# EAGLE design boat7 (EAGLE 7.6.0)
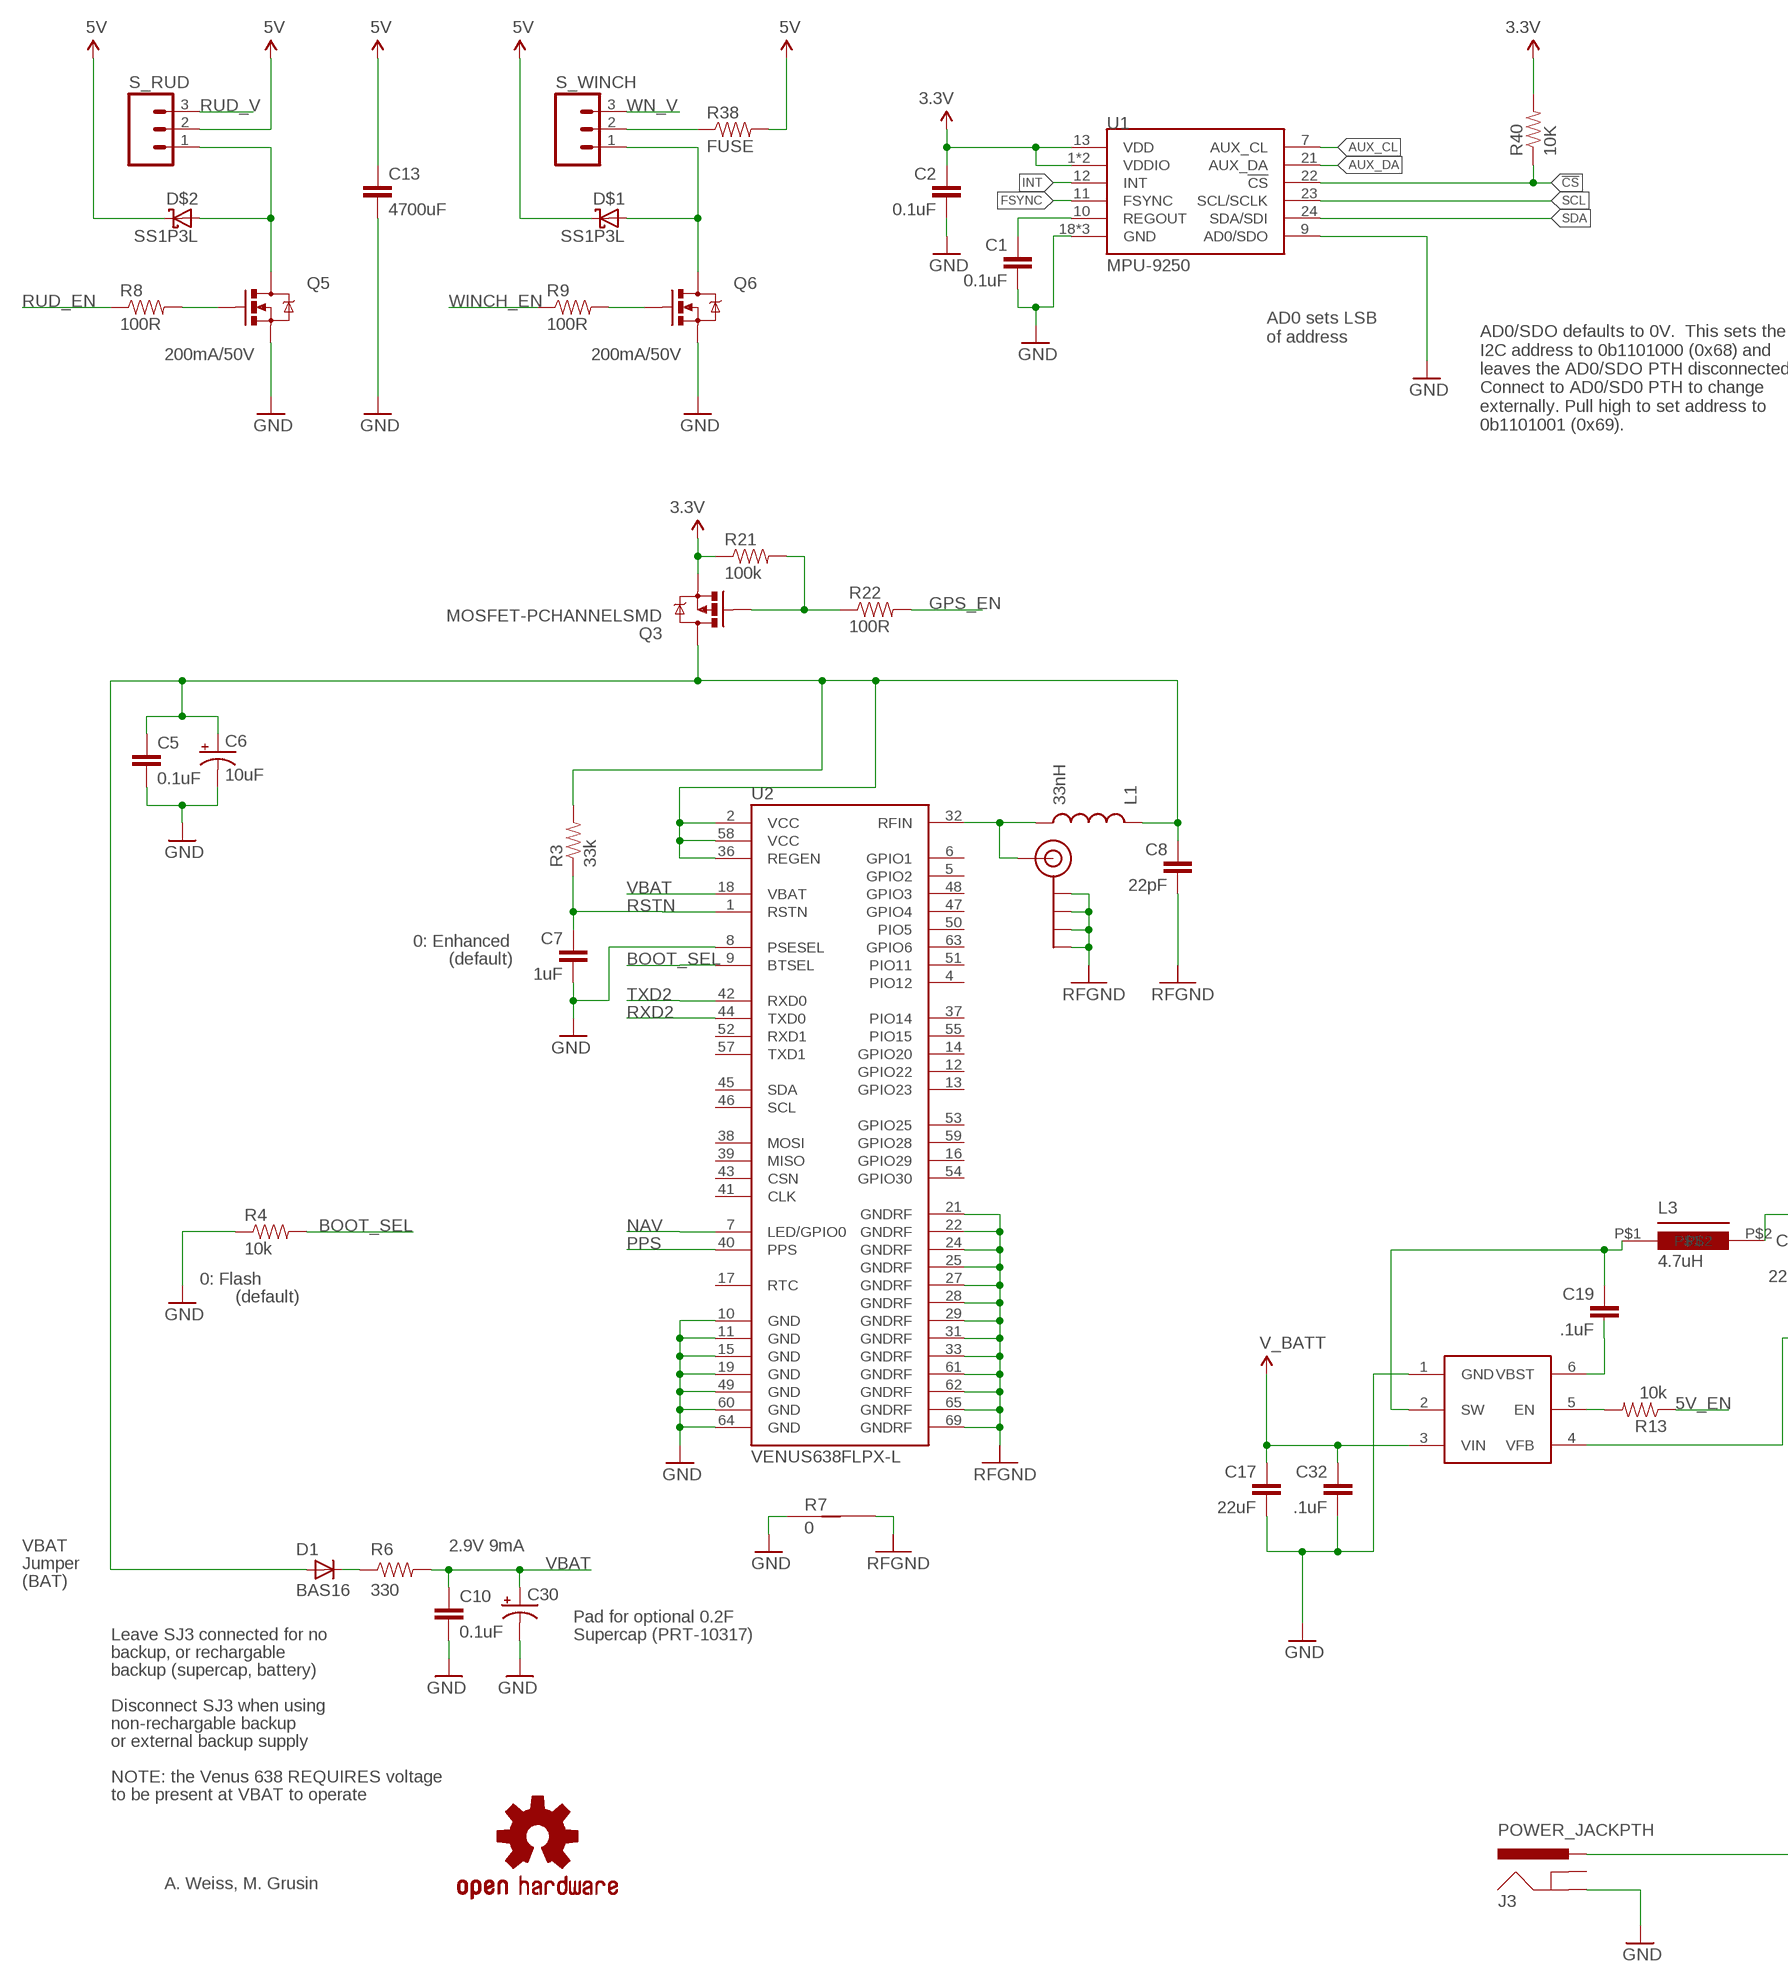
[diagram p0: schematic, sheet 1, part 1 of 2]
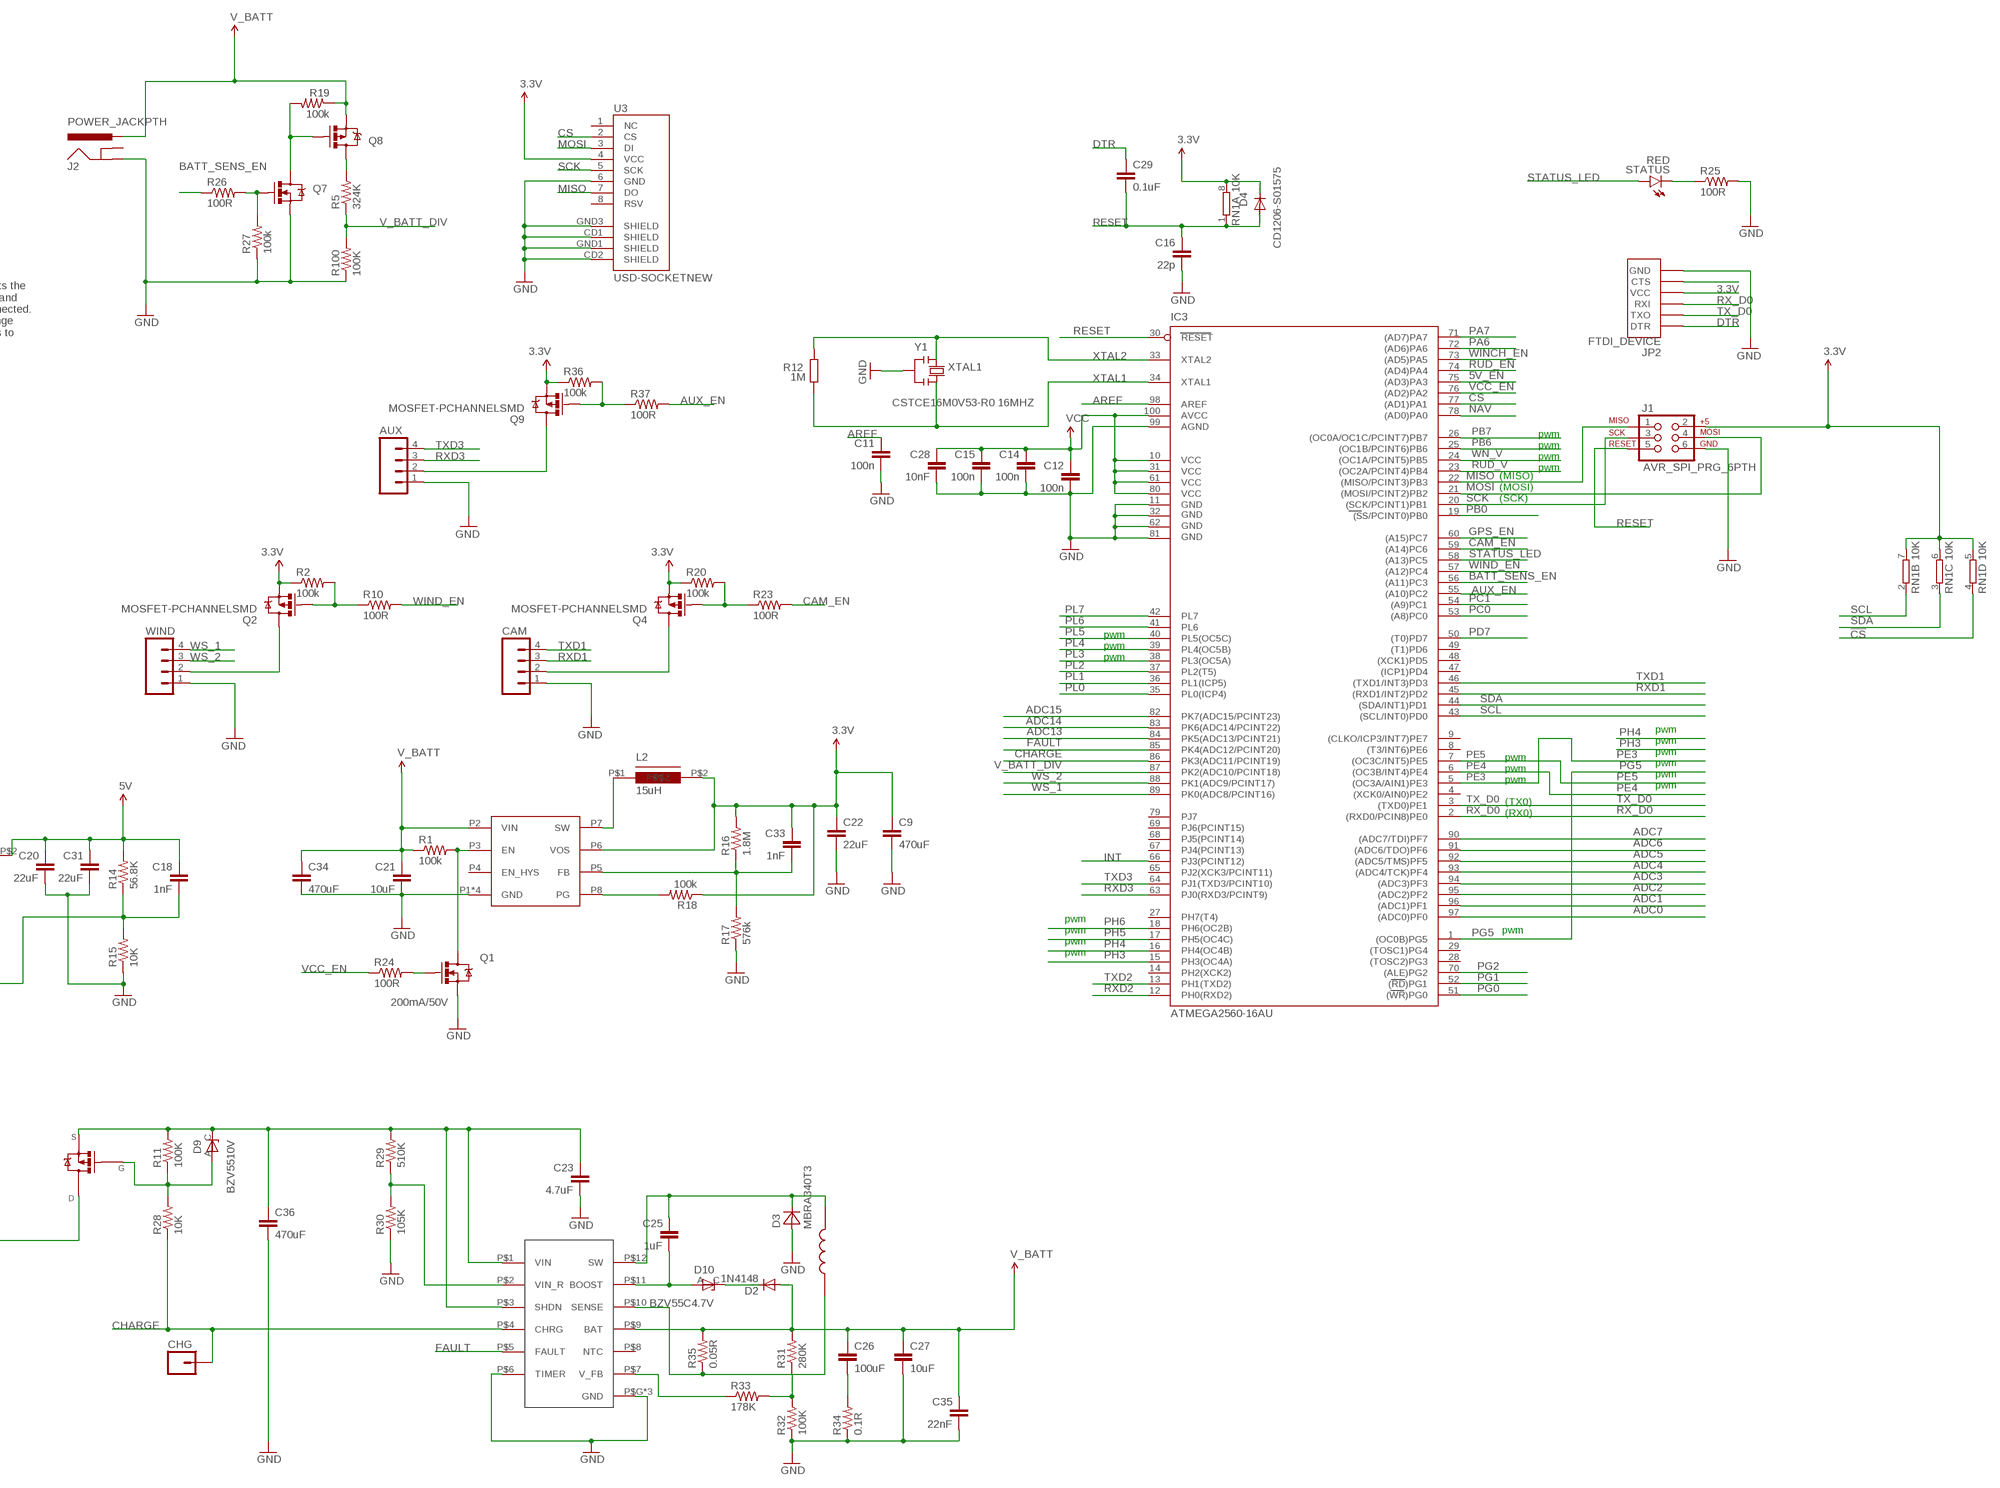
[diagram p1: schematic, sheet 1, part 2 of 2]

## Parts
AUX  M04PTH  [1X04]
C1  0.1uF  0.1UF-25V(+80/-20%)(0603)  [0603-CAP]
C2  0.1uF  0.1UF-25V(+80/-20%)(0603)  [0603-CAP]
C5  0.1uF  CAP0603-CAP  [0603-CAP]
C6  10uF  CAP_POL1206  [EIA3216]
C7  1uF  CAP0603-CAP  [0603-CAP]
C8  22pF  CAP0603-CAP  [0603-CAP]
C9  470uF  CAPPTH1  [CAP-PTH-5MM]
C10  0.1uF  CAP0603-CAP  [0603-CAP]
C11  100n  C-EU0603-RND  [C0603-ROUND]
C12  100n  C-EU0603-RND  [C0603-ROUND]
C13  4700uF  CAPPTH1  [CAP-PTH-5MM]
C14  100n  C-EU0603-RND  [C0603-ROUND]
C15  100n  C-EU0603-RND  [C0603-ROUND]
C16  22p  C-EU0603-RND  [C0603-ROUND]
C17  22uF  CAP1206  [1206]
C18  1nF  CAP0805  [0805]
C19  .1uF  CAP0805  [0805]
C20  22uF  CAP1206  [1206]
C21  10uF  CAP0805  [0805]
C22  22uF  CAP0805  [0805]
C23  4.7uF  CAP1206  [1206]
C25  1uF  CAP0805  [0805]
C26  100uF  CAP1210  [1210]
C27  10uF  CAP1210  [1210]
C28  10nF  CAP0603-CAP  [0603-CAP]
C29  0.1uF  CAP0603-CAP  [0603-CAP]
C30  CAP_POL  [DSK-621]
C31  22uF  CAP1206  [1206]
C32  .1uF  CAP0805  [0805]
C33  1nF  CAP0402-CAP  [0402-CAP]
C34  470uF  CAPPTH1  [CAP-PTH-5MM]
C35  22nF  CAP0805  [0805]
C36  470uF  CAPPTH1  [CAP-PTH-5MM]
CAM  M04PTH  [1X04]
CHG  M01PTH  [1X01]
D1  BAS16  DIODESOD  [SOD-323]
D2  1N4148  [MINIMELF]
D3  MBRA340T3  [SMA]
D4  CD1206-S01575  DIODE-SOD323-R  [SOD323-R]
D9  BZV5510V  BZV55  [MINIMELF]
D10  BZV55C4.7V  BZV55  [MINIMELF]
D$1  SS1P3L  [MICROSMP]
D$2  SS1P3L  [MICROSMP]
IC3  ATMEGA2560-16AU  ATMEGA25602560-16AU  [TQFP100]
J1  AVR_SPI_PRG_6PTH  [2X3]
J2  POWER_JACKPTH  [POWER_JACK_PTH]
J3  POWER_JACKPTH  [POWER_JACK_PTH]
JP2  FTDI_DEVICE  [FTDI_DEVICE_SIDE]
JP5  SMA_EDGE  [SMA-EDGE]
L1  33nH  INDUCTOR0603  [0603]
L2  15uH  VLCF4020  [VLCF4020]
L3  4.7uH  SLF60287055  [SLF7055]
Q1  200mA/50V  MOSFET-NCHANNELBSS138  [SOT23-3]
Q2  MOSFET-PCHANNELSMD  [SOT23-3]
Q3  MOSFET-PCHANNELSMD  [SOT23-3]
Q4  MOSFET-PCHANNELSMD  [SOT23-3]
Q5  200mA/50V  MOSFET-NCHANNELBSS138  [SOT23-3]
Q6  200mA/50V  MOSFET-NCHANNELBSS138  [SOT23-3]
Q7  200mA/50V  MOSFET-NCHANNELBSS138  [SOT23-3]
Q8  MOSFET-PCHANNELSMD  [SOT23-3]
Q9  MOSFET-PCHANNELSMD  [SOT23-3]
R1  100k  RESISTOR0603  [0603-RES]
R2  100k  RESISTOR0603  [0603-RES]
R3  33k  RESISTOR0603-RES  [0603-RES]
R4  10k  RESISTOR0603-RES  [0603-RES]
R5  324K  RESISTOR0603-RES  [0603-RES]
R6  330  RESISTOR0603-RES  [0603-RES]
R7  0  GND-JUMP  [GND-JUMP]
R8  100R  RESISTOR0603  [0603-RES]
R9  100R  RESISTOR0603  [0603-RES]
R10  100R  RESISTOR0603  [0603-RES]
R11  100K  RESISTOR0603  [0603-RES]
R12  1M  R-EU_R0603  [R0603-ROUND]
R13  10k  RESISTOR0603  [0603-RES]
R14  56.8K  RESISTOR0603  [0603-RES]
R15  10K  RESISTOR0603  [0603-RES]
R16  1.8M  RESISTOR0603  [0603-RES]
R17  576k  RESISTOR0603  [0603-RES]
R18  100k  RESISTOR0603  [0603-RES]
R19  100k  RESISTOR0603  [0603-RES]
R20  100k  RESISTOR0603  [0603-RES]
R21  100k  RESISTOR0603  [0603-RES]
R22  100R  RESISTOR0603  [0603-RES]
R23  100R  RESISTOR0603  [0603-RES]
R24  100R  RESISTOR0603  [0603-RES]
R25  100R  RESISTOR0603  [0603-RES]
R26  100R  RESISTOR0603  [0603-RES]
R27  100k  RESISTOR0603  [0603-RES]
R28  10K  RESISTOR0603  [0603-RES]
R29  510K  RESISTOR0603  [0603-RES]
R30  105K  RESISTOR0603  [0603-RES]
R31  280K  RESISTOR0603  [0603-RES]
R32  100K  RESISTOR0603  [0603-RES]
R33  178K  RESISTOR0603  [0603-RES]
R34  0.1R  RESISTOR1206  [1206]
R35  0.05R  RESISTOR1206  [1206]
R36  100k  RESISTOR0603  [0603-RES]
R37  100R  RESISTOR0603  [0603-RES]
R38  FUSE  RESISTORPTH-1/4W-VERT  [AXIAL-0.1]
R40  10K  10KOHM-1/10W-1%(0603)0603  [0603-RES]
R100  100K  RESISTOR0603-RES  [0603-RES]
RN1  10K  4R-NCAT16  [CAT16]
S_RUD  M03PTH  [1X03]
S_WINCH  M03PTH  [1X03]
STATUS  RED  LED-RED0603  [LED-0603]
U1  MPU-9250  [QFN24_PAD]
U2  VENUS638FLPX-L  [VENUS638FLPX]
U3  USD-SOCKETNEW  [MICRO-SD-SOCKET-PP]
U$1  TPS62125  [S-PWSON-N8]
U$2  TPS56X200  [SOT23-6]
U$4  OSHW-LOGOS  [OSHW-LOGO-S]
U$5  LT365212  [12-LEAD-MSOP-EXPOSED]
U$7  B82464G4  [B82464G4]
U$15  SI4401DDY  [SOIC-8]
WIND  M04PTH  [1X04]
Y1  CSTCE16M0V53-R0 16MHZ  RESONATORMU  [RESONATOR]

## Nets
3.3V: C2.1 C9.1 C12.1 C14.1 C15.1 C22.1 C28.1 C33.1 D4.C IC3.10(VCC) IC3.31(VCC1) IC3.61(VCC2) IC3.80(VCC3) IC3.100(AVCC) J1.2 JP2.P$4(VCC) L2.P$2 Q2.2(S) Q3.2(S) Q4.2(S) Q9.2(S) R2.1 R16.2 R18.1 R20.1 R21.1 R36.1 R40.2 RN1.5 RN1.6 RN1.7 RN1.8 U1.1(VDDIO) U1.8(VDDIO) U1.13(VDD) U3.4(VCC) U$1.P6(VOS) ; supply symbol labelled VCC
5V: C13.1 C18.1 C20.1 C31.1 D$1.C D$2.C L3.P$2 R14.2 R38.P$2 S_RUD.2
5V_EN: IC3.75((AD3)PA3) R13.1
!CS: R40.1 RN1.4 U1.22(!CS)
ADC0: IC3.97((ADC0)PF0)
ADC1: IC3.96((ADC1)PF1)
ADC2: IC3.95((ADC2)PF2)
ADC3: IC3.94((ADC3)PF3)
ADC4: IC3.93((ADC4/TCK)PF4)
ADC5: IC3.92((ADC5/TMS)PF5)
ADC6: IC3.91((ADC6/TDO)PF6)
ADC7: IC3.90((ADC7/TDI)PF7)
ADC13: IC3.84(PK5(ADC13/PCINT21))
ADC14: IC3.83(PK6(ADC14/PCINT22))
ADC15: IC3.82(PK7(ADC15/PCINT23))
ANT: JP5.SIG(SIGNAL) L1.2 U2.32(RFIN)
AREF: C11.1 IC3.98(AREF)
AUX_CL: U1.7(AUX_CL)
AUX_DA: U1.21(AUX_DA)
AUX_EN: IC3.55((A10)PC2) R37.2
BAT: C17.1 C21.1 C26.1 C27.1 C32.1 C34.1 C35.1 D2.A J2.PWR Q8.2(S) R1.1 R19.1 R31.2 R35.2 U$1.P2(VIN) U$2.3(VIN) U$5.P$9(BAT) ; supply symbol labelled V_BATT
BATT_SENS_EN: IC3.56((A11)PC3) R26.1
BOOST: C25.2 D10.A U$5.P$11(BOOST)
BOOT_SEL: R4.2 U2.9(BTSEL)
CAM_EN: IC3.59((A14)PC6) R23.2
CHARGE: CHG.1 IC3.86(PK3(ADC11/PCINT19)) R28.1 U$5.P$4(CHRG)
CS: IC3.77((AD1)PA1) U3.2(CS)
DTR: C29.1 JP2.P$1(DTR)
FAULT: IC3.85(PK4(ADC12/PCINT20)) U$5.P$5(FAULT)
FSYNC: U1.11(FSYNC)
GND: AUX.1 C1.2 C2.2 C5.2 C6.C(-) C7.2 C9.2 C10.2 C11.2 C12.2 C13.2 C14.2 C15.2 C16.2 C17.2 C20.2 C21.2 C22.2 C23.2 C27.2 C28.2 C30.GND(-) C31.2 C32.2 C34.2 C35.2 C36.2 CAM.1 D3.A IC3.11(GND) IC3.32(GND1) IC3.62(GND2) IC3.81(GND3) IC3.99(AGND) J1.6 J2.GND J3.GND JP2.P$6(GND) Q1.2(S) Q5.2(S) Q6.2(S) Q7.2(S) R4.1 R7.1 R15.1 R17.1 R25.2 R27.1 R30.1 R32.1 R34.1 R100.1 U1.9(AD0/SDO) U1.18(GND) U1.20(GND) U1.CENTER(GND) U2.8(PSESEL) U2.10(GND) U2.11(GND) U2.15(GND) U2.19(GND) U2.49(GND) U2.60(GND) U2.64(GND) U3.6(GND) U3.CD1(SHIELD) U3.CD2(SHIELD) U3.GND1(SHIELD) U3.GND3(SHIELD) U$1.P1(GND) U$1.P_THERM(GND) U$1.P_THERM_VIA1(GND) U$1.P_THERM_VIA(GND) U$2.1(GND) U$5.P$6(TIMER) U$5.P$G1(GND) U$5.P$G2(GND) U$5.P$G(GND) WIND.1 Y1.2
GPS_EN: IC3.60((A15)PC7) R22.2
GPS_PWR: C5.1 C6.A(+) C8.1 D1.2(A) L1.1 Q3.3(D) R3.2 U2.2(VCC) U2.36(REGEN) U2.58(VCC)
INT: IC3.66(PJ3(PCINT12)) U1.12(INT)
MISO: IC3.22((MISO/PCINT3)PB3) J1.1 U3.7(DO)
MOSI: IC3.21((MOSI/PCINT2)PB2) J1.4 U3.3(DI)
N$1: R38.P$1 S_WINCH.2
N$3: AUX.2 Q9.3(D)
N$4: C23.1 C36.1 D9.C(K) R11.2 R29.2 U$5.P$1(VIN) U$5.P$3(SHDN) U$15.1(S) U$15.2(S) U$15.3(S)
N$5: D1.1(C) R6.1
N$6: D9.A R11.1 R28.2 U$15.4(G)
N$7: Q5.1(G) R8.2
N$8: D$1.A Q6.3(D) S_WINCH.1
N$9: D$2.A Q5.3(D) S_RUD.1
N$10: Q6.1(G) R9.2
N$11: C19.1 L3.P$1 U$2.2(SW)
N$12: Q9.1(G) R36.2 R37.1
N$13: R31.1 R32.2 R33.2
N$14: L2.P$1 U$1.P7(SW)
N$15: R13.2 U$2.5(EN)
N$17: C33.2 R16.1 R17.2 U$1.P5(FB)
N$18: R18.2 U$1.P8(PG)
N$19: C18.2 R14.1 R15.2 U$2.4(VFB)
N$20: CAM.2 Q4.3(D)
N$21: Q4.1(G) R20.2 R23.1
N$22: Q3.1(G) R21.2 R22.1
N$23: Q1.3(D) R1.2 U$1.P3(EN)
N$24: Q1.1(G) R24.2
N$25: JP2.P$5(CTS)
N$26: Q2.3(D) WIND.2
N$27: R25.1 STATUS.C
N$28: Q2.1(G) R2.2 R10.1
N$29: Q8.3(D) R5.2
N$30: Q7.3(D) Q8.1(G) R19.2
N$31: Q7.1(G) R26.2 R27.2
N$32: C19.2 U$2.6(VBST)
N$36: C26.2 R34.2
N$37: D2.C D10.C(K)
NAV: IC3.78((AD0)PA0) U2.7(LED/GPIO0)
PA6: IC3.72((AD6)PA6)
PA7: IC3.71((AD7)PA7)
PB0: IC3.19((SS/PCINT0)PB0)
PB6: IC3.25((OC1B/PCINT6)PB6)
PB7: IC3.26((OC0A/OC1C/PCINT7)PB7)
PC0: IC3.53((A8)PC0)
PC1: IC3.54((A9)PC1)
PD7: IC3.50((T0)PD7)
PE3: IC3.5((OC3A/AIN1)PE3)
PE4: IC3.6((OC3B/INT4)PE4)
PE5: IC3.7((OC3C/INT5)PE5)
PG0: IC3.51((WR)PG0)
PG1: IC3.52((RD)PG1)
PG2: IC3.70((ALE)PG2)
PG5: IC3.1((OC0B)PG5)
PH3: IC3.15(PH3(OC4A))
PH4: IC3.16(PH4(OC4B))
PH5: IC3.17(PH5(OC4C))
PH6: IC3.18(PH6(OC2B))
PL0: IC3.35(PL0(ICP4))
PL1: IC3.36(PL1(ICP5))
PL2: IC3.37(PL2(T5))
PL3: IC3.38(PL3(OC5A))
PL4: IC3.39(PL4(OC5B))
PL5: IC3.40(PL5(OC5C))
PL6: IC3.41(PL6)
PL7: IC3.42(PL7)
PPS: U2.40(PPS)
REGOUT: C1.1 U1.10(REGOUT)
RESET: C16.1 C29.2 D4.A IC3.30(RESET) J1.5 RN1.1
RFGND: C8.2 JP5.GND@0(GND) JP5.GND@1(GND) JP5.GND@2(GND) JP5.GND@3(GND) R7.2 U2.21(GNDRF) U2.22(GNDRF) U2.24(GNDRF) U2.25(GNDRF) U2.27(GNDRF) U2.28(GNDRF) U2.29(GNDRF) U2.31(GNDRF) U2.33(GNDRF) U2.61(GNDRF) U2.62(GNDRF) U2.65(GNDRF) U2.69(GNDRF)
RSTN: C7.1 R3.1 U2.1(RSTN)
RUD_EN: IC3.74((AD4)PA4) R8.1
RUD_V: IC3.23((OC2A/PCINT4)PB4) S_RUD.3
RX_D0: IC3.2((RXD0/PCIN8)PE0) JP2.P$3(RXI)
RXD1: CAM.3 IC3.45((RXD1/INT2)PD2)
RXD2: IC3.12(PH0(RXD2)) U2.44(TXD0)
RXD3: AUX.3 IC3.63(PJ0(RXD3/PCINT9))
S_IN: J3.PWR U$15.5(D) U$15.6(D) U$15.7(D) U$15.8(D)
SCK: IC3.20((SCK/PCINT1)PB1) J1.3 U3.5(SCK)
SCL: IC3.43((SCL/INT0)PD0) RN1.2 U1.23(SCL/SCLK)
SDA: IC3.44((SDA/INT1)PD1) RN1.3 U1.24(SDA/SDI)
SENSE: R35.1 U$5.P$10(SENSE) U$7.P$1
STATUS_LED: IC3.58((A13)PC5) STATUS.A
SW: C25.1 D3.C U$5.P$12(SW) U$7.P$2
TX_D0: IC3.3((TXD0)PE1) JP2.P$2(TXO)
TXD1: CAM.4 IC3.46((TXD1/INT3)PD3)
TXD2: IC3.13(PH1(TXD2)) U2.42(RXD0)
TXD3: AUX.4 IC3.64(PJ1(TXD3/PCINT10))
V_BATT_DIV: IC3.87(PK2(ADC10/PCINT18)) R5.1 R100.2
VBAT: C10.1 C30.VCC(+) R6.2 U2.18(VBAT)
VCC_EN: IC3.76((AD2)PA2) R24.1
VFB: R33.1 U$5.P$7(V_FB)
VINR: R29.1 R30.2 U$5.P$2(VIN_R)
WINCH_EN: IC3.73((AD5)PA5) R9.1
WIND_EN: IC3.57((A12)PC4) R10.2
WN_V: IC3.24((OC1A/PCINT5)PB5) S_WINCH.3
WS_1: IC3.89(PK0(ADC8/PCINT16)) WIND.4
WS_2: IC3.88(PK1(ADC9/PCINT17)) WIND.3
XTAL1: IC3.34(XTAL1) R12.1 Y1.3
XTAL2: IC3.33(XTAL2) R12.2 Y1.1
Unconnected: IC3.4((XCK0/AIN0)PE2) IC3.8((T3/INT6)PE6) IC3.9((CLKO/ICP3/INT7)PE7) IC3.14(PH2(XCK2)) IC3.27(PH7(T4)) IC3.28((TOSC2)PG3) IC3.29((TOSC1)PG4) IC3.47((ICP1)PD4) IC3.48((XCK1)PD5) IC3.49((T1)PD6) IC3.65(PJ2(XCK3/PCINT11)) IC3.67(PJ4(PCINT13)) IC3.68(PJ5(PCINT14)) IC3.69(PJ6(PCINT15)) IC3.79(PJ7) J2.GNDBREAK J3.GNDBREAK U2.4(PIO12) U2.5(GPIO2) U2.6(GPIO1) U2.12(GPIO22) U2.13(GPIO23) U2.14(GPIO20) U2.16(GPIO29) U2.17(RTC) U2.37(PIO14) U2.38(MOSI) U2.39(MISO) U2.41(CLK) U2.43(CSN) U2.45(SDA) U2.46(SCL) U2.47(GPIO4) U2.48(GPIO3) U2.50(PIO5) U2.51(PIO11) U2.52(RXD1) U2.53(GPIO25) U2.54(GPIO30) U2.55(PIO15) U2.57(TXD1) U2.59(GPIO28) U2.63(GPIO6) U3.1(NC) U3.8(RSV) U$1.P4(EN_HYS) U$5.P$8(NTC)

## Notes on the sheet
- AD0/SDO defaults to 0V.  This sets the
  I2C address to 0b1101000 (0x68) and
  leaves the AD0/SDO PTH disconnected.
  Connect to AD0/SD0 PTH to change
  externally. Pull high to set address to
  0b1101001 (0x69).
- AD0 sets LSB
  of address
- pwm
- pwm
- pwm
- pwm
- (MISO)
- (MOSI)
- (SCK)
- pwm
- pwm
- pwm
- 0: Enhanced
- (default)
- RFGND | RFGND
- pwm
- pwm
- pwm
- pwm
- pwm
- pwm
- pwm
- pwm
- pwm
- (TX0)
- (RX0)
- 0: Flash
- (default)
- pwm
- pwm | pwm
- pwm
- pwm
- RFGND
- VBAT | 2.9V 9mA
- Jumper | RFGND
- (BAT)
- Pad for optional 0.2F
- Leave SJ3 connected for no | Supercap (PRT-10317)
- backup, or rechargable
- backup (supercap, battery)
- Disconnect SJ3 when using
- non-rechargable backup
- or external backup supply
- NOTE: the Venus 638 REQUIRES voltage
- to be present at VBAT to operate
- A. Weiss, M. Grusin

## Library data of the parts
AUX CAM WIND = SparkFun-Connectors:M04: Header 4 Standard 4-pin 0.1" header. Use with straight break away headers (SKU : PRT-00116), right angle break away headers (PRT-00553), swiss pins (PRT-00743), machine pins (PRT-00117), and female headers (PRT-00115). Molex polarized connector foot print use with SKU : PRT-08231 with associated crimp pins and housings. 1MM SMD Version SKU: PRT-10208; PROD_ID: CONN-09696
C1 C2 = SparkFun-Capacitors:0.1UF-25V(+80/-20%)(0603): CAP-00810 Ceramic Standard decoupling cap; PROD_ID: CAP-00810
C5 C7 C8 C10 = SparkFun:CAP: Capacitor Standard 0603 ceramic capacitor, and 0.1" leaded capacitor.
C6 = SparkFun:CAP_POL: Capacitor Polarized These are standard SMD and PTH capacitors. Normally 10uF, 47uF, and 100uF in electrolytic and tantalum varieties. Always verify the external diameter of the through hole cap, it varies with capacity, voltage, and manufacturer. The EIA devices should be standard.
C9 C13 C17-C23 C25-C27 C31 C32 C34-C36 = SparkFun-Capacitors:CAP: Capacitor Standard 0603 ceramic capacitor, and 0.1" leaded capacitor.
C11 C12 C14-C16 = SmartPrj:C-EU: CAPACITOR, European symbol
C28 C29 C33 = SparkFun-Passives:CAP: Capacitor Standard 0603 ceramic capacitor, and 0.1" leaded capacitor.
C30 = kolosy:CAP_POL: Capacitor Polarized These are standard SMD and PTH capacitors. Normally 10uF, 47uF, and 100uF in electrolytic and tantalum varieties. Always verify the external diameter of the through hole cap, it varies with capacity, voltage, and manufacturer. The EIA devices should be standard.
CHG = SparkFun-Connectors:M01: Header 1 Standard 1-pin 0.1" header. Use with straight break away headers (SKU : PRT-00116), right angle break away headers (PRT-00553), swiss pins (PRT-00743), machine pins (PRT-00117), and female headers (PRT-00115). SMTSO-256-ET is a "flush mount" nut for a 4-40 screw. The older package used to be too tight, and did not allow it to sit properly thru the drill hit. The latest (0.165DIA) fits nice and snug.
D1 = SparkFun:DIODE: Diode These are standard reverse protection diodes and small signal diodes. SMA package can handle up to about 1A. SOD-323 can handle about 200mA. What the SOD-323 package when ordering, there are some mfgs out there that are 5-pin packages.
D2 = kolosy:1N4148: DIODE high speed (Philips)
D3 = diode:MBRA340T3: Surface Mount Schottky Power Rectifier Source: http://www.onsemi.com/pub_link/Collateral/MBRA340T3-D.PDF
D4 = diode:DIODE-: DIODE
D9 D10 = kolosy:BZV55
D$1 D$2 = kolosy:SS1P3L: Surface Mount Schottky Barrier Rectifiers (http://www.vishay.com/docs/89020/mss1p3l.pdf)
IC3 = SmartPrj:ATMEGA2560: MICROCONTROLLER 64/128/256 Kbytes FLASH 4 Kbytes EEPROM 8 Kbytes SRAM 86 General Purpose I/O pins 12-channels16-bit PWM 4 x Serial USARTs 16-channels 10-bit A/D
J1 = SparkFun-Connectors:AVR_SPI_PRG_6: AVR ISP 6 Pin This is the reduced ISP connector for AVR programming. Common on Arduino. This footprint will take up less PCB space and can be used with a 10-pin to 6-pin adapter such as SKU: BOB-08508 **Special note about "TEST_POINT" package. The stop mask is on the top side, so if you want your programming test points to be on the bottom of your board, make sure to place this package on the bottom side of the board. This also ensure that the orientation to program from the bottom side will be correct.
J2 J3 = SparkFun-Connectors:POWER_JACK: Power Jack This is the standard 5.5mm barrel jack for power. The PTH is the most common, proven, reliable, footprint. The Slot footprint only works if the mill layer is transmitted to the PCB fab house so be warned. Mating wall wart : TOL-00298 (and others); PROD_ID: CONN-08197
JP2 = SparkFun-Connectors:FTDI_DEVICE: Connector which mates to FTDI basic or FTDI cable.
JP5 = SparkFun:SMA_EDGE: SMA Antenna Connector End launch SMA connector. The paste layer has been removed so that the connector can be hand soldered onto the board after reflow.
L1 = SparkFun:INDUCTOR: Inductors Basic Inductor/Choke - 0603 and 1206. Footprints are not proven and vary greatly between part numbers.
L2 = kolosy:VLCF4020
L3 = kolosy:SLF6028
Q1 Q5-Q7 = SparkFun-DiscreteSemi:MOSFET-NCHANNEL: Common NMOSFET Parts MFG P/N Store ID Prod ID FDD8780 TRANS-09984 SI7820DN TRANS-11055 FDS6630A IC-08089 2N7002PW TRANS-11151 FQP30N06L COM-10213 TRANS-10060 BSS123LT1G TRANS-08345 BSS138 TRANS-00830 BS170 2N7000; PROD_ID: TRANS-00830
Q2-Q4 Q8 Q9 = SparkFun-DiscreteSemi:MOSFET-PCHANNEL: Generic PMOSFET IRLML2244 - TRANS-11153 (SOT-23 -20V -4.3A) (1.Gate 2.Source 3.Drain) FQP27P06 - COM-10349 <http://www.sparkfun.com/products/10349> (TO-220 -60V -27A) (1.Gate 2.Source 3.Drain)
R1 R2 R8-R11 R13-R38 = SparkFun-Resistors:RESISTOR: Resistor Basic schematic elements and footprints for 0603, 1206, and PTH resistors.
R3 R4 R6 = SparkFun:RESISTOR: Resistor Basic schematic elements and footprints for 0603, 1206, and PTH resistors.
R5 R100 = SparkFun-Passives:RESISTOR: Resistor Basic schematic elements and footprints for 0603, 1206, and PTH resistors.
R7 = mike-temp:GND-JUMP: Zero-Ohm trace for connecting different ground planes at a single point.
R12 = SmartPrj:R-EU_: RESISTOR, European symbol
R40 = SparkFun-Resistors:10KOHM-1/10W-1%(0603): RES-00824; PROD_ID: RES-00824
RN1 = resistor-dil:4R-N: Array Chip Resistor Source: RS Component / Phycomp; OC_FARNELL: unknown; OC_NEWARK: unknown
S_RUD S_WINCH = SparkFun-Connectors:M03: Header 3 Standard 3-pin 0.1" header. Use with straight break away headers (SKU : PRT-00116), right angle break away headers (PRT-00553), swiss pins (PRT-00743), machine pins (PRT-00117), and female headers (PRT-00115). Molex polarized connector foot print use with SKU : PRT-08232 with associated crimp pins and housings.
STATUS = SparkFun-LED:LED-RED: Assorted Red LEDs LilyPad 1206- DIO-09912 1206- DIO-00809 0603- DIO-00819 "SMART" means more efficient and expensive; PROD_ID: DIO-00819
U1 = Testing:MPU-9250: NC pin 19. 2-6 & 14-17 not internally connected. May be used for PCB trace routing.; PROD_ID: IC-13192
U2 = mike-temp:VENUS638FLPX-L: Venus638FLPX-L GPS Receiver Venus638FLPx is a high performance, low cost, single chip GPS receiver targeting mobile consumer and cellular handset applications. It offers very low power consumption, high sensitivity, and best in class signal acquisition and time-to-first-fix performance. Venus638FLPx contains all the necessary components of a complete GPS receiver, includes 1.2dB cascaded system NF RF front-end, GPS baseband signal processor, 0.5ppm TCXO, 32.768kHz RTC crystal, RTC LDO regulator, and passive components. It requires very low external component count and takes up only 100mm2 PCB footprint. Dedicated massive-correlator signal parameter search engine within the baseband enables rapid search of all the available satellites and acquisition of very weak signal. An advanced track engine allows weak signal tracking and positioning in harsh environments such as urban canyons and under deep foliage. The self-contained architecture keeps GPS processing off the host and allows integration into applications with very little resource. FEATURES 20Hz update rate -148dBm cold start sensitivity -165dBm tracking sensitivity 29 second cold start TTFF 3.5 second TTFF with AGPS 1 second hot start 2.5m accuracy Multipath detection and suppression Jamming detection and mitigation SBAS (WAAS / EGNOS) support 7-day extended ephemeris AGPS 67mW full power navigation Works directly with active or passive antenna Internal flash for optional 75K point data logging Supports external SPI flash memory data logging Complete receiver in 10mm x 10mm x 1.3mm size Contains LNA, SAW Filter, TCXO, RTC Xtal, LDO Pb-free RoHS compliant
U3 = SparkFun:USD-SOCKET: microSD Socket Push-push type uSD socket. Schematic element and footprint production proven. Spark Fun Electronics SKU : PRT-00127. tDoc lines correctly indicate media card edge positions when inserting (unlocked, locked, depressed).
U$1 = kolosy:TPS62125
U$2 = kolosy:TPS56X200
U$4 = SparkFun:OSHW-LOGO: Open Source Hardware Logo This logo indicates the piece of hardware it is found on incorporates a OSHW license and/or adheres to the definition of open source hardware found here: http://freedomdefined.org/OSHW
U$5 = kolosy:LT3652: The LT®3652 is a complete monolithic step-down battery charger that operates over a 4.95V to 32V input voltage range. The LT3652 provides a constant-current/ constant-voltage charge characteristic, with maximum charge current externally programmable up to 2A. The charger employs a 3.3V float voltage feedback reference, so any desired battery float voltage up to 14.4V can be programmed with a resistor divider.
U$7 = kolosy:B82464G4
U$15 = kolosy:SI4401DDY: VISHAY P-Channel 40 V (D-S) MOSFET
Y1 = SmartPrj:RESONATOR

## Net classes
2 gnd: width 0.305 mm, drill 0.406 mm, clearance 0.203 mm
3 power usb: width 0.508 mm, drill 0.406 mm, clearance 0.203 mm

## Board
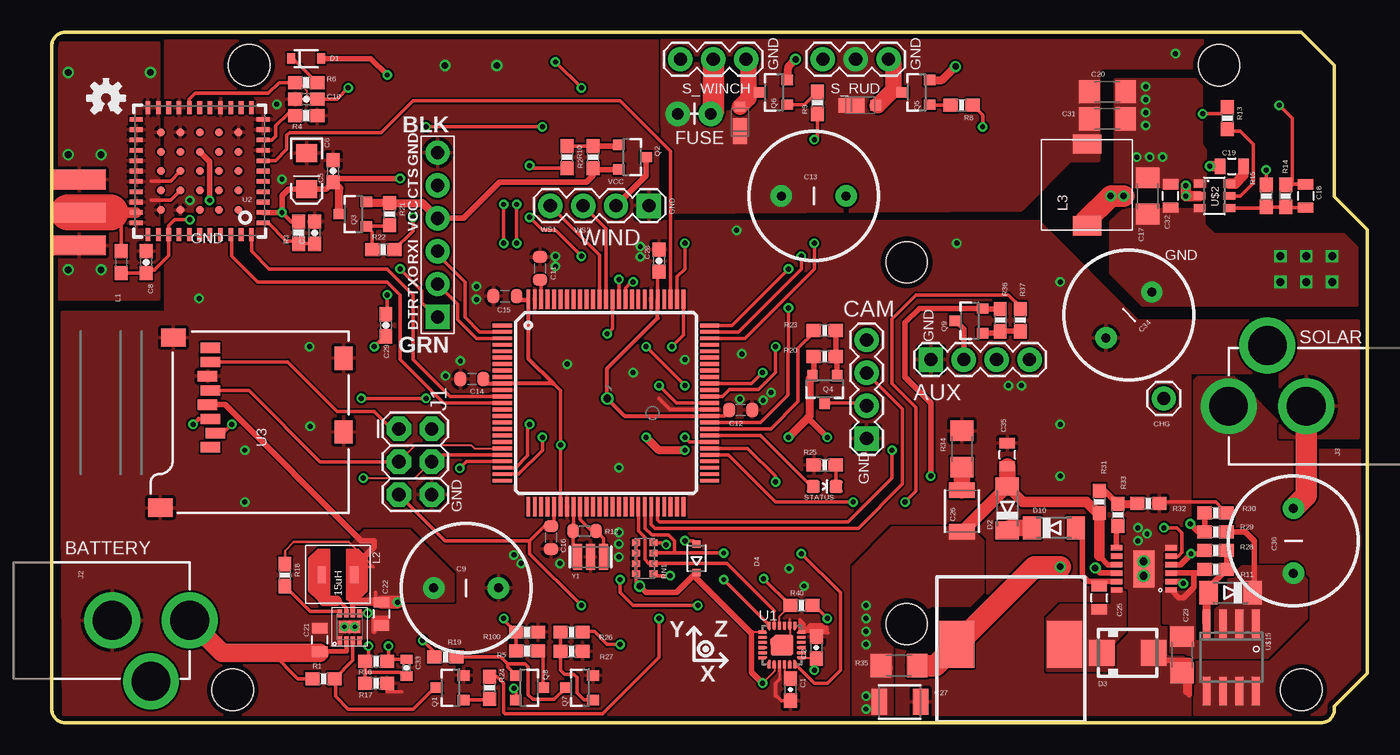
[diagram p2: board, top side]
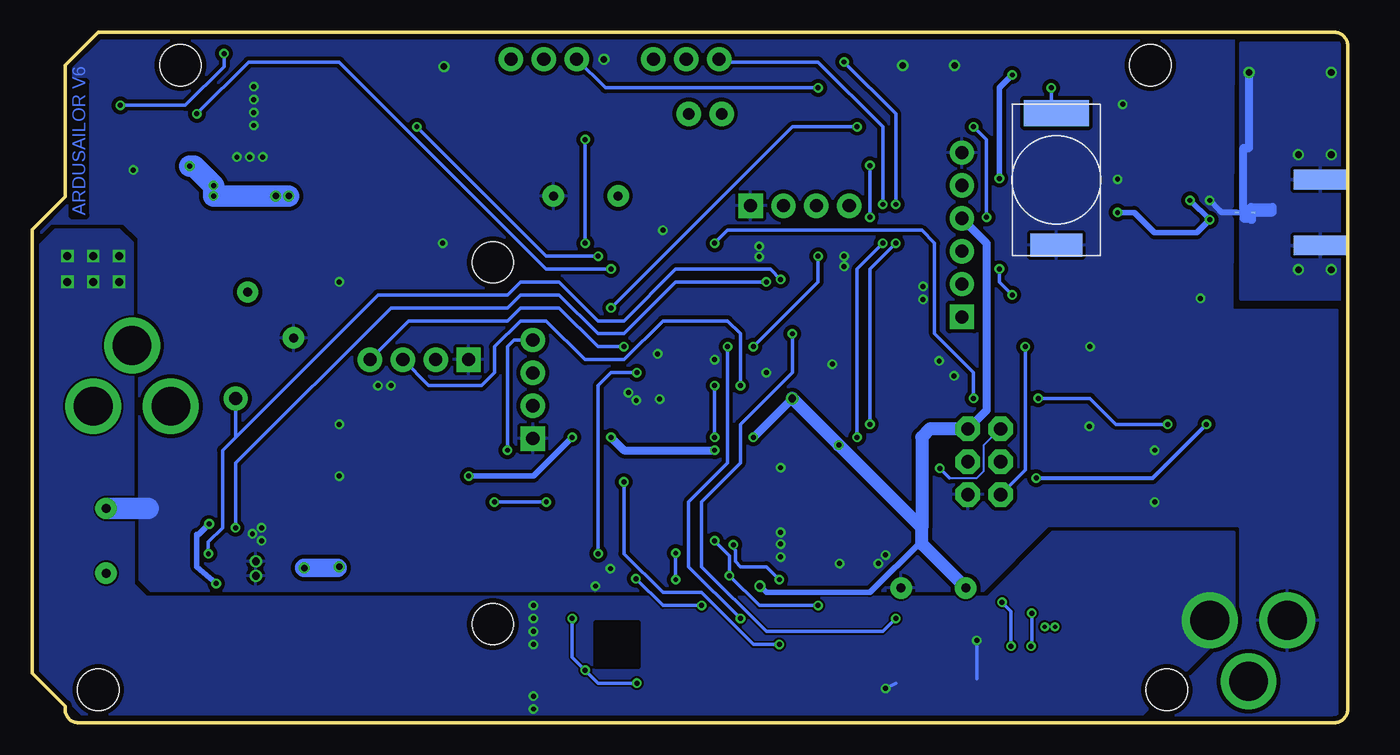
[diagram p3: board, bottom side, seen from below]

Size 101.6 x 53.34 mm. Coordinates in mm from the lower left corner, seen from the top.
Outline: 96.52,53.34 99.06,50.8 99.06,40.64 101.6,38.1 101.6,3.81 99.06,1.27 99.06,1 arc-90 98.06,0 1,0 arc-90 0,1 0,52.34 arc-90 1,53.34 96.52,53.34
Copper layers (1*16): Top 0.0356mm / dielectric 1.5011mm / Bottom 0.0356mm
Design rules "oshpark *": minimum track width 0.1523mm, minimum drill 0.3301mm, track to track 0.1523mm, track to pad 0.1523mm, pad to pad 0.1523mm, via to via 0.1523mm, smd to smd 0.1523mm, copper to edge 0.3809mm, drill to drill 0.1523mm, minimum pad ring 7mil, minimum via ring 7mil, stop-mask expansion 3mil, vias tented up to drill 15mil, thermal gap 10mil
Holes 3.2 mm at 96.52,2.54 15.24,50.8 90.17,50.8 13.97,2.54 66.04,35.56 66.04,7.62
bRestrict: area 54.8,4.3 to 58,7.7

### Footprints (pad centres in the part's own frame; a part is rotated, then mirrored left to right if it is on the bottom)
1X04 = drill 1.016 pad 1.88 square: 1 0,0 | drill 1.016 pad 1.88: 2 2.54,0; 3 5.08,0; 4 7.62,0
0603-CAP = smd 1.1 x 1: 1 -0.85,0; 2 0.85,0
EIA3216 = smd 1.4 x 1.6: A 1.4,0; C -1.4,0
CAP-PTH-5MM = drill 0.7 pad 1.651: 1 -2.5,0; 2 2.5,0
C0603-ROUND = smd 0.898 x 1.1: 1 -0.889,0; 2 0.889,0
1206 = smd 1.6 x 1.8: 1 -1.4,0; 2 1.4,0
0805 = smd 0.8 x 1.2: 1 -0.9,0; 2 0.9,0
1210 = smd 1.2 x 2: 1 -1.6,0; 2 1.6,0
DSK-621 = smd 4 x 1.8: GND 0,-5.05 | smd 5 x 2: VCC 0,5.15
0402-CAP = smd 0.7 x 0.9: 1 -0.65,0; 2 0.65,0
1X01 = drill 1.016 pad 1.88: 1 0,0
SOD-323 = smd 0.63 x 0.83: 1 -1.15,0; 2 1.15,0
MINIMELF = smd 1.4 x 1.8: A 1.7,0; C -1.7,0
SMA = smd 2 x 2: A 2,0; C -2,0
SOD323-R = smd 0.6 x 0.6: A 1.1,0; C -1.1,0
MICROSMP = smd 0.8 x 0.8: A 1.2,0 | smd 2 x 1.1: C -0.7,0
TQFP100 = smd 1.5 x 0.3: 1 -8,6; 2 -8,5.5; 3 -8,5; 4 -8,4.5; 5 -8,4; 6 -8,3.5; 7 -8,3; 8 -8,2.5; 9 -8,2; 10 -8,1.5; 11 -8,1; 12 -8,0.5; 13 -8,0; 14 -8,-0.5; 15 -8,-1; 16 -8,-1.5; 17 -8,-2; 18 -8,-2.5; 19 -8,-3; 20 -8,-3.5; 21 -8,-4; 22 -8,-4.5; 23 -8,-5; 24 -8,-5.5; 25 -8,-6; 51 8,-6; 52 8,-5.5; 53 8,-5; 54 8,-4.5; 55 8,-4; 56 8,-3.5; 57 8,-3; 58 8,-2.5; 59 8,-2; 60 8,-1.5; 61 8,-1; 62 8,-0.5; 63 8,0; 64 8,0.5; 65 8,1; 66 8,1.5; 67 8,2; 68 8,2.5; 69 8,3; 70 8,3.5; 71 8,4; 72 8,4.5; 73 8,5; 74 8,5.5; 75 8,6 | smd 0.3 x 1.5: 26 -6,-8; 27 -5.5,-8; 28 -5,-8; 29 -4.5,-8; 30 -4,-8; 31 -3.5,-8; 32 -3,-8; 33 -2.5,-8; 34 -2,-8; 35 -1.5,-8; 36 -1,-8; 37 -0.5,-8; 38 0,-8; 39 0.5,-8; 40 1,-8; 41 1.5,-8; 42 2,-8; 43 2.5,-8; 44 3,-8; 45 3.5,-8; 46 4,-8; 47 4.5,-8; 48 5,-8; 49 5.5,-8; 50 6,-8; 76 6,8; 77 5.5,8; 78 5,8; 79 4.5,8; 80 4,8; 81 3.5,8; 82 3,8; 83 2.5,8; 84 2,8; 85 1.5,8; 86 1,8; 87 0.5,8; 88 0,8; 89 -0.5,8; 90 -1,8; 91 -1.5,8; 92 -2,8; 93 -2.5,8; 94 -3,8; 95 -3.5,8; 96 -4,8; 97 -4.5,8; 98 -5,8; 99 -5.5,8; 100 -6,8
2X3 = drill 1.016 pad 1.88 octagon: 1 0,0; 2 0,2.54; 3 2.54,0; 4 2.54,2.54; 5 5.08,0; 6 5.08,2.54
POWER_JACK_PTH = drill 2.997 pad 4.318: GND 0,7.7; GNDBREAK 4.7,10.7; PWR 0,13.7
FTDI_DEVICE_SIDE = drill 1.016 pad 1.88 square: P$1 -6.35,0 | drill 1.016 pad 1.88: P$2 -3.81,0; P$3 -1.27,0; P$4 1.27,0; P$5 3.81,0; P$6 6.35,0
SMA-EDGE = smd 1.524 x 4.064: GND@0 0,0; GND@1 5.08,0; SIG 2.54,0 | smd 1.524 x 4.064 bottom: GND@2 0,0; GND@3 5.08,0
0603 = smd 1.1 x 1: 1 -0.85,0; 2 0.85,0
VLCF4020 = smd 1.27 x 0.635: P$1 0,1.27; P$2 0,-1.27
SLF7055 = smd 1.5 x 2.2: P$1 -3.15,0; P$2 3.15,0
SOT23-3 = smd 0.8 x 0.9: 1 -0.95,-1; 2 0.95,-1; 3 0,1.1
0603-RES = smd 1.1 x 1: 1 -0.85,0; 2 0.85,0
GND-JUMP = smd 0.305 x 0.152: 1 -0.635,0; 2 0.635,0
R0603-ROUND = smd 0.898 x 1.1: 1 -0.889,0; 2 0.889,0
AXIAL-0.1 = drill 0.9 pad 1.88: P$1 0,0; P$2 2.54,0
CAT16 = smd 0.5 x 0.65: 1 -1.2,-0.675; 2 -0.4,-0.675; 3 0.4,-0.675; 4 1.2,-0.675; 5 1.2,0.675; 6 0.4,0.675; 7 -0.4,0.675; 8 -1.2,0.675
1X03 = drill 1.016 pad 1.88: 1 0,0; 2 2.54,0; 3 5.08,0
LED-0603 = smd 1 x 1: A 0,-0.877; C 0,0.877
QFN24_PAD = smd 0.5 x 0.25: 1 -1.55,1; 2 -1.55,0.6; 3 -1.55,0.2; 4 -1.55,-0.2; 5 -1.55,-0.6; 6 -1.55,-1; 13 1.55,-1; 14 1.55,-0.6; 15 1.55,-0.2; 16 1.55,0.2; 17 1.55,0.6; 18 1.55,1 | smd 0.08 x 0.13: 1$1 -1.32,1.06; 1$3 -1.26,0.94; P$33 1.26,-0.94; P$34 1.32,-1.06; P$58 1.26,0.94; P$59 1.32,1.06; P$68 -1.26,-0.94; P$69 -1.32,-1.06 | smd 0.1 x 0.185 rotated 45: 1$2 -1.25,1.024; P$49 1.024,-1.25 | smd 0.14 x 0.14: 1$4 -1.22,0.945; P$23 -0.945,-1.22; P$24 1.22,-0.945; P$36 0.945,1.22; P$51 0.945,-1.22; P$56 1.22,0.945; P$61 -0.945,1.22; P$66 -1.22,-0.945 | smd 0.05 x 0.05: 1$5 -1.175,0.97; P$25 -0.97,-1.175; P$31 1.175,-0.97; P$37 0.97,1.175; P$52 0.97,-1.175; P$57 1.175,0.97; P$62 -0.97,1.175; P$67 -1.175,-0.97 | smd 0.25 x 0.5: 7 -1,-1.55; 8 -0.6,-1.55; 9 -0.2,-1.55; 10 0.2,-1.55; 11 0.6,-1.55; 12 1,-1.55; 19 1,1.55; 20 0.6,1.55; 21 0.2,1.55; 22 -0.2,1.55; 23 -0.6,1.55; 24 -1,1.55 | smd 0.25 x 0.25: CENTER 0,0 | smd 0.4 x 0.4: DBBADFE -0.675,0.24 | smd 0.6 x 1.2: DBBADFE1 -0.575,-0.195 | smd 0.25 x 0.3: P$1 -0.2,1.3; P$3 0.2,1.3; P$5 0.6,1.3; P$11 -0.6,1.3; P$16 0.2,-1.3; P$18 -0.2,-1.3; P$20 -0.6,-1.3; P$26 0.6,-1.3 | smd 0.3 x 0.25: P$2 -1.3,0.2; P$4 -1.3,0.6; P$28 -1.3,-0.2; P$38 -1.3,-0.6; P$40 1.3,0.2; P$42 1.3,-0.2; P$44 1.3,-0.6; P$50 1.3,0.6 | smd 0.1 x 0.185 rotated 225: P$7 1.25,-1.024; P$60 -1.024,1.25 | smd 1.1 x 1.59: P$13 0.325,0 | smd 0.3 x 0.5 rotated 315: P$14 -0.592,0.512 | smd 0.5 x 1.59: P$15 -0.27,0 | smd 0.1 x 0.185 rotated 135: P$22 -1.024,-1.25; P$55 1.25,1.024 | smd 0.13 x 0.08: P$27 -0.94,-1.26; P$29 -1.06,-1.32; P$39 0.94,1.26; P$41 1.06,1.32; P$53 0.94,-1.26; P$54 1.06,-1.32; P$63 -0.94,1.26; P$64 -1.06,1.32 | smd 0.1 x 0.185 rotated 315: P$35 1.024,1.25; P$65 -1.25,-1.024
VENUS638FLPX = smd 1 x 0.36: 1 -4.9,4; 2 -4.9,3.2; 3 -4.9,2.4; 4 -4.9,1.6; 5 -4.9,0.8; 6 -4.9,0; 7 -4.9,-0.8; 8 -4.9,-1.6; 9 -4.9,-2.4; 10 -4.9,-3.2; 11 -4.9,-4; 23 4.9,-4; 24 4.9,-3.2; 25 4.9,-2.4; 26 4.9,-1.6; 27 4.9,-0.8; 28 4.9,0; 29 4.9,0.8; 30 4.9,1.6; 31 4.9,2.4; 32 4.9,3.2; 33 4.9,4 | smd 0.36 x 1: 12 -4,-4.9; 13 -3.2,-4.9; 14 -2.4,-4.9; 15 -1.6,-4.9; 16 -0.8,-4.9; 17 0,-4.9; 18 0.8,-4.9; 19 1.6,-4.9; 20 2.4,-4.9; 21 3.2,-4.9; 22 4,-4.9; 34 4,4.9; 35 3.2,4.9; 36 2.4,4.9; 37 1.6,4.9; 38 0.8,4.9; 39 0,4.9; 40 -0.8,4.9; 41 -1.6,4.9; 42 -2.4,4.9; 43 -3.2,4.9; 44 -4,4.9 | smd 0.6 x 0.6: 45 -3,3; 46 -3,1.5; 47 -3,0; 48 -3,-1.5; 49 -3,-3; 50 -1.5,3; 51 -1.5,1.5; 52 -1.5,0; 53 -1.5,-1.5; 54 -1.5,-3; 55 0,3; 56 0,1.5; 57 0,0; 58 0,-1.5; 59 0,-3; 60 1.5,3; 61 1.5,1.5; 62 1.5,0; 63 1.5,-1.5; 64 1.5,-3; 65 3,3; 66 3,1.5; 67 3,0; 68 3,-1.5; 69 3,-3
MICRO-SD-SOCKET-PP = smd 0.8 x 1.5: 1 -8.94,10.7; 2 -7.84,10.3; 3 -6.74,10.7; 4 -5.64,10.9; 5 -4.54,10.7; 6 -3.44,10.9; 7 -2.34,10.7; 8 -1.24,10.7 | smd 1.8 x 1.4: CD1 -2.05,0.4; CD2 -7.75,0.4 | smd 1.4 x 1.9: GND1 -13.6,14.55; GND3 -0.45,13.55
S-PWSON-N8 = smd 0.35 x 0.64: P1 -0.75,-1.06; P2 -0.25,-1.06; P3 0.25,-1.06; P4 0.75,-1.06; P5 0.75,1.05; P6 0.25,1.05; P7 -0.25,1.05; P8 -0.75,1.05 | smd 1.6 x 0.9: P_THERM 0,0 | drill 0.33: P_THERM_VIA -0.4,0; P_THERM_VIA1 0.4,0
SOT23-6 = smd 0.6 x 0.9: 1 -0.95,-1.15; 2 0,-1.15; 3 0.95,-1.15; 4 0.95,1.15; 5 0,1.15; 6 -0.95,1.15
12-LEAD-MSOP-EXPOSED = smd 0.42 x 0.889: P$1 0.21,0.445; P$2 0.86,0.445; P$3 1.51,0.445; P$4 2.16,0.445; P$5 2.81,0.445; P$6 3.46,0.445; P$7 3.46,4.655; P$8 2.81,4.655; P$9 2.16,4.655; P$10 1.51,4.655; P$11 0.86,4.655; P$12 0.21,4.655 | smd 2.845 x 1.651: P$G 1.835,2.55 | drill 0.6: P$G1 2.41,2.56; P$G2 1.29,2.56
B82464G4 = smd 2.7 x 3.6: P$1 0,0; P$2 8.3,0
SOIC-8 = smd 0.6 x 2.2: 1 -1.905,-2.6; 2 -0.635,-2.6; 3 0.635,-2.6; 4 1.905,-2.6; 5 1.905,2.6; 6 0.635,2.6; 7 -0.635,2.6; 8 -1.905,2.6
RESONATOR = smd 0.7 x 2: 1 -1,0; 2 0,0; 3 1,0

### Placement (x,y rotation side)
AUX  67.9,28.05 0 top
C1  57.05,2.55 270 top
C2  59.05,5.8 90 top
C5  21.73,42.62 90 top
C6  19.67,42.62 270 top
C7  20.29,37.86 90 top
C8  7.28,35.58 90 top
C9  32,10.4 0 top
C10  19.65,48.18 180 top
C11  37.7,35.1 90 top
C12  53.2,24.15 0 top
C13  58.85,40.7 0 top
C14  32.45,26.55 180 top
C15  35,32.95 180 top
C16  38.55,14.3 270 top
C17  84.65,40.7 90 top
C18  96.85,40.7 270 top
C19  91.15,43 0 top
C20  81.55,48.75 0 top
C21  20.7,6.4 90 top
C22  25.45,8.4 270 top
C23  87.3,5.25 270 top
C25  80.9,9.65 90 top
C26  70.3,16.35 90 top
C27  65.5,1.6 0 top
C28  46.9,35.7 90 top
C29  25.8,30.7 270 top
C30  22.5,41.95 0 bottom
C31  81.55,46.65 0 top
C32  86.4,40.7 90 top
C33  27.4,4.25 270 top
C34  83.2,31.5 225 top
C35  73.8,20.7 90 top
C36  95.9,14.05 90 top
CAM  62.94,21.95 90 top
CHG  85.9,25.05 0 top
D1  19.64,51.31 0 top
D2  73.8,16.55 90 top
D3  83.1,5.4 0 top
D4  49.8,12.7 90 top
D9  91.05,10.05 180 top
D10  77.4,15.05 0 top
D$1  53.15,46.4 90 top
D$2  62.45,47.7 0 top
IC3  42.8,24.7 0 top
J1  26.8,22.7 270 top
J2  -3.05,7.9 270 top
J3  104.6,24.45 90 top
JP2  29.8,37.7 90 top
JP5  2.12,41.96 270 top
L1  5.36,35.58 90 top
L2  22.1,11.45 90 top
L3  79.95,41.55 90 top
Q1  30.8,2.7 90 top
Q2  44.8,43.7 270 top
Q3  23.3,39.3 90 top
Q4  59.7,25.8 180 top
Q5  66.8,48.7 90 top
Q6  55.8,48.7 90 top
Q7  40.8,2.7 90 top
Q8  36.85,2.7 270 top
Q9  70.9,31.05 90 top
R1  21,3.4 0 top
R2  41.8,43.7 90 top
R3  19.07,37.86 90 top
R4  19.65,46.91 180 top
R5  36.7,5.55 0 top
R6  19.65,49.44 180 top
R7  7.93,39.42 0 bottom
R8  70.28,47.7 180 top
R9  59.13,47.89 90 top
R10  39.8,43.7 270 top
R11  89.9,11.85 180 top
R12  41.15,14.8 180 top
R13  90.8,46.7 270 top
R14  95.3,40.7 90 top
R15  93.8,40.7 270 top
R16  25.05,4.75 0 top
R17  25.05,3.05 180 top
R18  18,11.4 270 top
R19  30.4,5.1 0 top
R20  59.7,28.3 0 top
R21  26.1,39.3 270 top
R22  25.6,36.55 0 top
R23  59.7,30.3 180 top
R24  33.8,2.7 270 top
R25  59.7,19.9 180 top
R26  40.15,7 180 top
R27  40.15,5.5 180 top
R28  89.9,13.3 0 top
R29  89.9,14.75 0 top
R30  89.9,16.2 180 top
R31  80.9,17.05 270 top
R32  84.7,16.95 180 top
R33  82.35,16.05 90 top
R34  70.3,21.15 270 top
R35  65.45,4.4 180 top
R36  73.25,31.1 270 top
R37  74.8,31.1 90 top
R38  50.9,47.05 180 top
R40  57.9,9.05 0 top
R100  36.7,7 180 top
RN1  45.8,12.7 90 top
S_RUD  64.63,51.26 180 top
S_WINCH  53.63,51.26 180 top
STATUS  59.7,18.25 270 top
U1  56.4,6 0 top
U2  11.42,42.62 180 top
U3  22.93,30.21 90 top
U$1  23,7.4 0 top
U$2  89.8,40.7 270 top
U$4  4.19,48.25 0 top
U$5  86.9,10.05 90 top
U$7  69.9,6.05 0 top
U$15  91.1,5.05 180 top
WIND  46.12,39.94 180 top
Y1  41.6,12.8 0 top

### Tracks (layer width: path | path; a pad name or v marks a point on that pad's centre or on a via)
3.3V  (via drill 0.38, 0.5, 0.6)
  Top 0.152: 54.1,7 U1.1 | U1.13 59,5 | U1.8 55.8,3.95 v54.9,3.05
  Top 0.203: L2.P$2 23.36,12.04 24.85,12.03 22.92,13.96 18.68,13.96 18,13.28 R18.1 | 35.7,32.65 C15.1 | 36.77,32.65 IC3.100 | R16.2 26,4.86
  Top 0.254: 26,4.85 26,4.86 v26,5.9 | 33.19,26.2 C14.1 | C15.1 35.69,32.81 | IC3.61 51.96,23.7 C12.1 | IC3.100 36.14,32.7 C15.1 | 35.8,33.04 C15.1 | 25.35,9.35 25,9.7 25,10.05 | 26,4.86 26,4.9 C33.1 | v45.4,10.55 45.12,10.83 RN1.8 RN1.7 RN1.6 RN1.5 | C28.1 46.8,34.75 IC3.80 | 59,5 C2.1 58.9,4.8 v58.9,4.05 | R40.2 58.9,9.05 v59.9,8.05 | 54.05,6.9 54.05,6.95 54.1,7 | IC3.31 v39.3,21.45 39.3,25.65 38.75,26.2
  Top 0.305: IC3.61 44.25,23.7 v42.9,25.05 42.9,27.35 46.8,31.25 IC3.80 | 35.7,33.07 35.7,32.65 36.8,32.65 36.8,28.15 38.75,26.2 IC3.10 33.19,26.2
  Top 0.406: U$1.P6 23.25,9.35 | C14.1 33.25,26.3 | v45.4,10.55 45.9,10.05 48.25,10.05 D4.C 49.8,11.15 54.05,6.9 54.05,3.9 v54.9,3.05 | JP2.P$4 31.82,38.97 34.6,41.75 41.3,41.75 41.8,42.25 R2.1 41.9,42.75 Q2.2 | R20.1 58.85,26.9 Q4.2 | R36.1 71.95,31.95 Q9.2 67,32 65.9,30.9 65.9,26.7 67.9,24.7 v67.9,19.05 | v59.9,22.05 58.4,23.55 | 23.36,12.04 24.9,13.58 24.9,14.05 23.9,14.05 13.38,24.57 U3.4
  Top 0.61: 23.25,10.55 23.25,9.35 25.35,9.35 C22.1 | JP2.P$4 28.62,40.15 R21.1 24.4,40.15 Q3.2 | v56.9,22.05 58.4,23.55 58.55,23.7 58.55,26.6 Q4.2 | v48.9,21.05 46.9,21.05 v45.9,22.05
  Top 1.016: v26.7,9.3 C22.1
  Bottom 0.254: v26,5.9 26,8.6 v26.7,9.3 | v54.9,3.05 57.9,3.05 v58.9,4.05 59.9,5.05 v59.9,8.05
  Bottom 0.406: 32.9,14.05 36.9,10.05 44.9,10.05 v45.4,10.55 | v67.9,19.05 62.9,19.05 v59.9,22.05
  Bottom 0.61: JP2.P$4 29.8,38.95 27.9,37.05 27.9,24.14 J1.2 | v42.9,25.05 v45.9,22.05 | v56.9,22.05 55.9,21.05 v48.9,21.05
  Bottom 1.016: J1.2 32.25,22.7 32.9,22.05 32.9,15.05 | C9.1 32.9,13.8 32.9,14.05 32.9,15.05 | 32.9,15.05 v39.3,21.45 v42.9,25.05
  pour Top (no thermals): 24.15,14.8 27.65,14.8 31,11.45 31,9.4 24,9.4 24,10.4 22.9,10.4 22.9,13.5
5V  (via drill 0.38)
  Top 0.254: v94.8,47.7 95.8,46.7 95.8,41.55 R14.2 95.35,41.6 C18.1
  Bottom 0.254: v86.8,51.7 86.8,50.7 89.8,47.7 v94.8,47.7
  pour Top (no thermals): 47.25,39.5 47.2,52.7 88.8,52.7 88.8,50.7 81.15,50.7 80.8,50.45 80.8,43.5 78.6,43.5 74.8,39.7
5V_EN  (via drill 0.38)
  Top 0.254: IC3.75 52.55,30.7 v56.9,35.05 | v88.9,47.05 90.3,47.05 R13.1
  Bottom 0.254: v56.9,35.05 61.9,35.05 77.9,51.05 84.9,51.05 v88.9,47.05
!CS  (via drill 0.38)
  Top 0.152: U1.22 56.2,8.2 R40.1
  Top 0.254: RN1.4 47.3,13.9 v47.45,13.75 | v54.98,11.12 R40.1 | v43.9,11.05 43.9,10.05 44.9,9.05 v49.9,9.05
  Bottom 0.254: v47.45,13.75 47.45,13.45 47.3,13.3 47.3,12.45 46.9,12.05 44.9,12.05 v43.9,11.05 | v49.9,9.05 52.9,9.05 v54.98,11.12
ANT
  Top 0.254: L1.2 5.36,39.13 5.07,39.42 | JP5.SIG
  Top 0.813: U2.32 5.07,39.42 4.54,39.42
  Top 2.769: 1.26,39.42 JP5.SIG 4.54,39.42
AREF
  Top 0.254: IC3.98 37.8,34.11 C11.1
AUX_EN  (via drill 0.38)
  Top 0.254: IC3.55 52.25,20.7 55.9,17.05 v61.9,17.05 | v65.9,17.05 66.75,17.9 66.75,24.35 64.9,26.2 64.9,31.2 66.75,33.05 73.9,33.05 74.8,32.15 R37.2
  Bottom 0.254: v61.9,17.05 v65.9,17.05
BAT  (via drill 0.38, 0.6)
  Top 0.254: R1.1 19,3.4 17,5.4 | 29.55,5.4 R19.1 29.55,5.45 v28.65,6.35 | Q8.2 35.85,2.5 v35.7,2.65
  Top 0.35: U$1.P2 22.75,5.5 C21.1
  Top 0.406: U$5.P$9 81.59,12.21 80.9,12.9 | 74.25,19.35 C35.1 | R31.2 80.75,16.2
  Top 0.61: 20.7,5.4 C21.1 | 73.9,18.35 D2.A
  Top 0.813: 80.9,12.9 R31.2 | 80.75,16.2 79.9,17.05 75,17.05 D2.A
  Top 1.016: C26.1 D2.A
  Top 1.27: 64.3,4.25 R35.2 | D2.A C35.1
  Top 1.422: 20.7,5.4 17,5.4 13.15,5.4 J2.PWR
  Bottom 0.254: v35.7,2.65 34.9,3.05 | v28.65,6.35 28.65,3.4
  other vias: 94.9,36.05 94.9,34.05 98.9,34.05 98.9,36.05 62.9,1.05 62.9,2.05 62.9,6.05 62.9,7.05 62.9,8.05 62.9,9.05 96.9,36.05 96.9,34.05
  pour Top (no thermals): 100.8,32.25 100.8,36.7 99.8,37.7 89.8,37.7 89,38.5 89,39.65 82.8,39.65 81.8,38.7 81.8,34.7 84.25,32.25
  pour Bottom (rank 2, no thermals): 8.8,14.7 22.8,14.7 27.8,9.7 92.8,9.7 93.8,10.7 93.9,37.1 94.9,38.05 99.85,38.05 101.8,36.1 101.8,4.7 97.8,0.7 15.8,0.7 8.8,7.7
  pour Top (no thermals): 64.9,6.05 64.9,0.05 61.9,0.05 61.9,12.05 64.9,15.05 70.9,15.05 71.9,14.05 71.9,10.05 70.9,9.05 67.9,9.05
BATT_SENS_EN  (via drill 0.38)
  Top 0.254: IC3.56 53.75,21.2 55.9,19.05 v55.9,18.6 | v43.9,6.05 42.9,6.05 41.9,7.05 41.05,7.05 R26.1
  Bottom 0.254: v55.9,18.6 55.9,13.05 52.9,10.05 49.9,10.05 45.9,6.05 v43.9,6.05
BOOST
  Top 0.406: U$5.P$11 80.9,10.91 | 80.9,10.91 80.04,10.91 79.6,11.35 79.6,14.55 D10.A | C25.2 80.9,10.91
BOOT_SEL
  Top 0.254: U2.9 16.98,45.01 17.29,45.32 17.29,46.11 18.25,47.06 18.82,47.06 R4.2
CAM_EN
  Top 0.254: IC3.59 55.55,22.7 57.65,24.8 57.65,28.95 58.85,30.15 R23.2
CHARGE  (via drill 0.38)
  Top 0.254: v43.8,34.25 IC3.86
  Top 0.406: U$5.P$4 87.16,12.21 v88,13.05 88.8,13.05 R28.1
  Bottom 0.254: v43.8,34.25 44.6,35.05 51.9,35.05 55.9,31.05 57.9,31.05 60.9,34.05 63.9,34.05 64.9,33.05 74.9,33.05 85.9,22.05 | 85.9,22.05 86.9,21.05 86.9,15.05 88,13.95 v88,13.05 | CHG.1 85.9,22.05
CS  (via drill 0.38)
  Top 0.254: v48.9,37.05 48.9,35.05 48.3,34.45 IC3.77 | U3.2 13.22,22.37 v13.9,23.05 | v23.9,25.05 v28.9,25.05
  Bottom 0.254: v28.9,25.05 28.9,27.05 31.9,30.05 31.9,37.05 32.9,38.05 47.9,38.05 v48.9,37.05 | v13.9,23.05 17.9,23.05 19.9,25.05 v23.9,25.05
DTR  (via drill 0.38)
  Top 0.254: C29.1 25.9,31.45 v25.9,33.05 | v26.9,35.05 28.55,33.4 28.55,32.45 29.65,31.35 JP2.P$1
  Bottom 0.254: v25.9,33.05 26.9,34.05 v26.9,35.05
FAULT  (via drill 0.38)
  Top 0.254: U$5.P$5 87.01,12.86 87.3,13.15 87.3,14.65 86.9,15.05 v85.9,15.05 | v44.9,34.05 44.75,34.05 44.3,33.6 IC3.85
  Bottom 0.254: v85.9,15.05 85.9,20.05 73.9,32.05 64.9,32.05 63.9,33.05 60.9,33.05 57.9,30.05 55.9,30.05 51.9,34.05 v44.9,34.05
GND  (via drill 0.38, 0.5, 0.51)
  Top 0.152: 57,8 U1.20 57,6.5 | 57.95,7.3 U1.18 58.7,7 | U1.9 56.2,3.35
  Top 0.254: R15.1 v93.8,42.7 | R17.1 25.9,2.4 27,2.4 | R32.1 85.65,17.05 89.9,17.05 90.4,16.5 90.4,16.2 R30.1 | 57,6.5 56.9,6.5 U1.CENTER | U1.9 56.2,3.95 | 58.7,7 C2.2 | 56.2,3.35 55.9,3.05 55.9,2.05 56,2.05 56.35,1.7 C1.2 | IC3.62 47.75,24.2 46.9,25.05 | 58.45,7.45 58.55,7.55 59.5,7.55 59.6,7.45 59.65,7.45 59.88,7.22 59.88,7.02 | 57.9,7.05 58.9,7.05 59,6.95 59.95,6.95 59.88,7.02 | 59.88,7.02 59.75,7.15 57.8,7.15 57.8,7.95 58.1,7.65 58.1,7.35 58.15,7.3 59.85,7.3 59.85,7.4
  Top 0.406: 95.55,16.2 C36.2 | 86.05,4.75 86.1,4.8 87.85,4.8 87.85,2.15 87.6,2.4 87.6,4.5 | 25.9,8.05 24.9,8.05 24.9,7.05
  Top 0.61: Q5.2 68.75,49.65 v69.8,50.7 | Q6.2 56.9,50.7 v57.45,51.25
  Top 1.27: U$5.P$G2 U$5.P$G
  Top 1.676: C36.2 96.9,17.55 J3.GND
  Bottom 0.406: 9.72,39.42 U2.60 v10.66,40.36
  Bottom 0.445: R7.1 9.72,39.42
  Bottom 1.676: C36.2 92.65,16.55
  other vias: 17.77,41.98 32.8,33.7 43.8,14.7 53.3,28.5 45.45,36 45.45,36.8 32.8,32.7 54.95,24.9 56.95,11.9 58.1,10.55 19.95,22.9 43.8,13.8 43.8,12.8 35.7,12.95 36.25,12.3 17.37,47.78 30.37,50.78 34.37,50.78 19.9,29.05 14.9,17.05 85.8,43.7 84.8,43.7 83.8,43.7 84.5,46.15 84.5,47.15 84.5,48.15 84.5,49.15 11.37,32.78 83.9,15.05 83.9,14.05 84.6,14.6 38.9,36.05 38.9,35.25 39.25,12.3 31.55,27.95 30.4,26.8 74.9,26.05 73.9,26.05 44.9,27.05 77.9,23.05 77.9,19.05 77.9,34.05 69.9,37.05 52.9,38.05 53.15,25 48.9,28.05 55.55,25.5 39.8,27.7 43.8,19.7 14.9,21.05
  pour Bottom (isolate 0.305, rank 6): 8.8,52.72 96.8,52.7 96.82,52.65 97.8,51.65 98.9,50.45 98.9,40.05 100.88,38.07 100.9,38.07 100.9,4.05 98.9,2.05 98.9,0.05 1.86,0.04 0.8,0.7 0.8,31.89 8.74,31.89 8.9,32.05
  pour Top (rank 2): 46.8,38.7 76.25,38.7 83.9,31.05 100.9,31.05 100.9,22.05 94.9,22.05 94.9,27.05 87.9,27.05 87.9,0.05 0.9,0.05 0.8,16 0.8,31.7 8.8,31.7 8.8,52.7 46.8,52.7
  pour Top (no thermals): 20,8.4 21.2,8.4 21.8,7.8 22.35,7.8 22.35,6.15 21.5,6.15 21.5,6.4 15,6.4 15,9.4 19,9.4
  pour Top (no thermals): 23,7.85 26,7.85 26,8.4 31,8.4 31,6.4 24.4,6.4 24.4,7 23.5,7 23.5,7.4 23,7.4
  pour Top (no thermals): 89.1,44.25 89.1,41.4 82.15,41.4 82.15,49.7 88.8,49.7 88.8,44.7
  pour Top (rank 4, no thermals): 81.9,16.05 87.9,16.05 87.9,3.05 86.9,2.05 83.9,2.05 81.9,4.05
GPS_EN  (via drill 0.38)
  Top 0.254: R22.2 27.9,38 v27.9,39.05 | v28.9,46.05 v37.9,46.05 | v56.9,32.05 56.85,25.3 54.75,23.2 IC3.60
  Bottom 0.254: v27.9,39.05 27.9,45.05 v28.9,46.05 | v37.9,46.05 42.9,46.05 v56.9,32.05
GPS_PWR  (via drill 0.38)
  Top 0.254: 7.91,34.98 9.02,36.09 U2.36 9.01,37.73 9.01,38.39 9.48,38.86 v10.66,38.86 | 5.41,34.98 L1.1 C8.1 | U2.58 11.42,44.2
  Top 0.305: 7.91,34.98 7.28,34.98 C8.1 | R3.2 18.48,38.71 v17.77,39.42
  Top 0.406: v12.18,40.36 12.18,43.36 U2.58 | U2.2 v17.77,39.42 17.77,40.71 18.27,41.22 C6.A 21.18,41.22 C5.1 22.01,42.05 v26.9,42.05 | D1.2 24.63,51.31 v25.9,50.05
  Top 0.61: Q3.3 22.2,41.3 C5.1
  Bottom 0.406: v12.18,40.36 v10.66,38.86 11.66,37.86 14.91,37.86 16.47,39.42 v17.77,39.42 | v25.9,50.05 26.9,49.05 v26.9,42.05
INT  (via drill 0.38)
  Top 0.254: IC3.66 54.05,26.2 v54.9,27.05 | v57.9,13.05 60.9,10.05 60.9,4.05 59.9,3.05 58.9,3.05 57.55,4.4 57.45,4.4 U1.12
  Bottom 0.254: v54.9,27.05 56.9,27.05 57.9,26.05 v57.9,13.05
MISO  (via drill 0.38)
  Top 0.254: U3.7 18.23,27.87 22.05,24.05 24.9,24.05 26.25,22.7 J1.1 | IC3.22 32.05,20.2 v31.5,19.65
  Bottom 0.152: 30.75,18.9 28.65,18.9 28.1,19.45 28.1,21.45 26.85,22.7
  Bottom 0.254: v31.5,19.65 30.75,18.9 | 26.85,22.7 J1.1
MOSI  (via drill 0.38)
  Top 0.152: v24.05,18.9 28.05,18.9 29.31,20.16
  Top 0.254: IC3.21 29.88,20.7 J1.4 29.31,20.16
  Top 0.305: v10.9,23.05 11.32,23.47 U3.3
  Bottom 0.305: v24.05,18.9 15.05,18.9 v10.9,23.05
N$1
  Top 0.813: S_WINCH.2 51.09,50.99
  Top 1.676: R38.P$1 51.09,47.24 S_WINCH.2
N$3
  Top 0.406: AUX.2 70.44,30.41 Q9.3
N$4
  Top 0.406: U$5.P$3 88.19,11.56 | 88.19,11.56 88.76,11.56 R11.2 | 88.19,11.56 88.2,11.55 88.2,10.45 87.4,9.65 87.07,9.65 U$5.P$1 | R29.2 92.2,14.75 92.9,14.05 92.9,10.2 D9.C
  pour Top (no thermals): 90.9,9.7 90.9,11.05 91.9,12.05 95.9,12.05 96.9,11.05 96.9,8.05 93.9,5.05 88,5.05 87.55,5.45 86.45,5.45 86.45,7.7 85.9,7.7 85.9,10.05 88.25,10.05 88.25,6.25 89.9,6.25 89.9,8.7
N$5
  Top 0.254: D1.1 18.63,51.31 R6.1
N$6
  Top 0.406: D9.A 89.2,10.3 R11.1 R28.2
  Top 0.61: U$15.4 89.2,9.65 89.01,9.85 89,9.85 D9.A
N$7
  Top 0.254: R8.2 67.85,47.7 Q5.1
N$8
  Top 0.254: Q6.3 53.8,48.7
  Top 1.27: S_WINCH.1 53.8,51.09 53.8,49.05 53.8,48.7 53.8,48.25 D$1.A
N$9
  Top 0.254: Q5.3 65.35,49.15 64.8,49.7 64.8,51.09 S_RUD.1
  Top 1.016: D$2.A 63.8,47.7
  Top 1.27: 63.8,47.7 65,48.9 65,50.89 S_RUD.1
N$10
  Top 0.254: Q6.1 58.14,47.75 R9.2
N$11  (via drill 0.38, 0.4, 0.5)
  Top 0.813: U$2.2 v87.6,40.7 v87.6,41.5 | 79.8,38.7 79.5,38.7 L3.P$1 | C19.1 v89.45,43
  Top 1.676: 79.8,38.7 v81.8,40.7 v82.8,40.7
  Bottom 1.676: v81.8,40.7 v87.6,40.7 v87.6,41.5 89.1,43 v89.45,43
N$12
  Top 0.406: Q9.1 73.1,30.1 R36.2 R37.1
N$13
  Top 0.406: R31.1 81.35,17.9 R33.2
  Top 0.61: R33.2 83.8,16.9 R32.2
N$14
  Top 0.254: 22.2,9.4 22,9.4
  Top 0.305: U$1.P7 22.75,8.85 22.2,9.4
  Top 0.813: 22,9.4 21,9.4 20.83,9.72 L2.P$1
N$15
  Top 0.254: U$2.5 91.8,40.7 92.8,41.7 92.8,44.7 91.8,45.7 90.8,45.7 R13.2
N$17  (via drill 0.38)
  Top 0.254: R17.2 24.2,3.9 | 24.2,3.9 R16.1 24.45,4.75 v24.45,5.9 | v24.4,8.45 U$1.P5 | C33.2 27.4,3.75 27.05,3.75 26.9,3.9 24.2,3.9
  Bottom 0.254: v24.4,8.45 24.4,5.95 v24.45,5.9
N$18
  Top 0.254: R18.2 19.95,8.6 22.1,8.6 U$1.P8
N$19
  Top 0.254: U$2.4 93.7,39.75 R15.2 R14.1 95.35,39.8 C18.2
N$20
  Top 0.254: Q4.3 62.73,24.7 CAM.2
N$21
  Top 0.406: Q4.1 60.65,28.2 R20.2 R23.1
N$22
  Top 0.254: R22.1 24.75,37.9 Q3.1 26,38.35 R21.2
N$23
  Top 0.254: U$1.P3 23.25,4.8 R1.2 21.9,3.35 21.9,2.05 22.9,1.05 27.9,1.05 29.55,2.7 Q1.3
N$24
  Top 0.254: Q1.1 33.7,1.75 R24.2
N$26
  Top 0.406: WIND.2 45.9,42.26 Q2.3
N$27
  Top 0.254: 60.43,19.78 R25.1 60.55,18.28 STATUS.C
N$28
  Top 0.254: R2.2 R10.1
  Top 0.406: Q2.1 43.7,44.55 R2.2
N$29
  Top 0.254: R5.2 37.95,5.15 Q8.3
N$30
  Top 0.254: R19.2 34.65,5.1 35.2,4.55 | 35.2,4.55 36.55,4.55 36.8,4.3 36.8,2.15 37.15,1.8 38.8,1.8 Q7.3 | 35.2,4.55 35.2,4.3 Q8.1
N$31
  Top 0.254: Q7.1 41.1,1.75 40.55,2.3 40.55,3.5 40.3,3.75 39.6,3.75 39.3,4.05 R27.2 R26.2
N$32
  Top 0.813: U$2.6 91.4,41.65 92.05,42.3 C19.2
N$36
  Top 1.27: C26.2 R34.2
N$37
  Top 1.27: D2.C 74,15.05 D10.C
NAV
  Top 0.254: U2.7 17.27,43.42 18.15,44.3 18.15,45.4 18.35,45.6 25.45,45.6 27.9,48.05 43.9,48.05 47.8,44.15 IC3.78
REGOUT
  Top 0.152: U1.10 56.6,3.85 C1.1
RESET  (via drill 0.38)
  Top 0.254: IC3.30 38.8,15.44 C16.1 38.04,15.19 36.9,14.05 | RN1.1 46.62,11.35 v47.75,11.35 | v40.9,9.05 36.9,13.05 36.9,14.05 | J1.5 30.37,14.05 36.9,14.05 | v24.9,29.05 25.8,29.95 C29.2 | v48.9,14.05 49.55,14.05 D4.A
  Bottom 0.254: v40.9,9.05 45.45,9.05 v47.75,11.35 47.75,12.9 v48.9,14.05 | J1.5 24.9,19.52 v24.9,29.05
RFGND  (via drill 0.51)
  Top 0.254: U2.61 9.16,40.36 7.66,40.36 | U2.62 9.16,41.86 7.66,41.86
  Bottom 0.61: R7.2 5.8,39.42 5.8,39.45 8.05,39.45 8.05,38.95 7.4,38.95 7.4,38.85 7.45,38.85 7.45,39.85 5.8,39.85 5.8,39.7 8.05,39.7 8.05,44.4 7.61,44.4 v7.61,50.24
  other vias: 3.8,35 1.26,50.24 1.26,35 1.26,43.89 3.8,43.89
  pour Top: 8.25,32.73 8.25,52.51 -0.01,52.51 -0.01,32.73
  pour Bottom: 8.25,32.73 8.25,52.51 -0.01,52.51 -0.01,32.73
RSTN
  Top 0.254: U2.1 16.69,38.62 18.1,37.21 18.87,37.21 R3.1 C7.1
RUD_EN  (via drill 0.38)
  Top 0.254: IC3.74 53.05,30.2 57.9,35.05 v57.9,36.05 | v71.9,46.05 71.9,46.93 R8.1
  Bottom 0.254: v57.9,36.05 61.9,36.05 v71.9,46.05
RUD_V  (via drill 0.38)
  Top 0.254: IC3.23 35.8,19.7 36.75,20.65 36.75,22.9 v36.9,23.05 | v34.9,37.05 v34.9,40.05 | v38.9,51.05 v40.9,49.05
  Bottom 0.254: v36.9,23.05 36.9,35.05 v34.9,37.05 | v34.9,40.05 34.9,47.05 v38.9,51.05 | v40.9,49.05 57.34,49.05 S_RUD.3
RX_D0
  Top 0.254: JP2.P$3 29.8,36.15 31.9,34.05 31.9,31.35 33.05,30.2 IC3.2
RXD1
  Top 0.254: IC3.45 46.3,15.3 46.6,15 62.3,15 65.7,18.45 65.7,24.25 62.94,27.01 CAM.3
RXD2
  Top 0.254: U2.44 15.43,36.42 16.8,35.05 25.9,35.05 27.9,33.05 27.9,28.05 30.75,25.2 IC3.12
RXD3  (via drill 0.38)
  Top 0.254: IC3.63 48.25,24.7 v46.9,26.05
  Bottom 0.254: v46.9,26.05 46.9,30.05 47.9,31.05 52.9,31.05 55.9,28.05 58.9,28.05 61.9,31.05 63.9,31.05 65.9,29.05 65.9,27.05 66.9,26.05 70.98,26.05 AUX.3
S_IN
  pour Top (rank 3, no thermals): 87.9,26.05 88.9,27.05 90.9,27.05 95.9,22.05 95.9,21.05 101.9,21.05 101.9,4.05 98.9,1.05 98.9,0.05 88.9,0.05 87.9,1.05 87.9,5.05 85.9,5.05 85.9,8.05 87.9,8.05
SCK
  Top 0.152: J1.3 28.09,21.45 32.4,21.45 32.65,21.2 IC3.20
  Top 0.254: J1.3 20.74,20.16 15.23,25.67 U3.5
SCL
  Top 0.152: U1.23 55.8,8.65
  Top 0.254: IC3.43 45.3,14.8 45.8,14.3 45.8,12.6 46.1,12.3 RN1.2 52.15,12.3 55.8,8.65
SDA  (via drill 0.38)
  Top 0.254: RN1.3 48.1,13.1 | 48.1,13.1 v51.9,13.1 51.95,13.1 | IC3.44 45.8,15 46.35,14.5 47.65,14.5 48.1,14.05 48.1,13.1 | U1.24 v51.9,11.05
  Bottom 0.254: v51.9,11.05 v51.9,13.1
SENSE  (via drill 0.5)
  Top 0.406: U$5.P$10 80.99,11.56 v80.6,11.95
  Top 1.676: R35.1 68.25,4.4 U$7.P$1 75.9,12.05 v77.9,12.05
  Bottom 0.813: 78,11.95 v77.9,12.05
  Bottom 1.422: v80.6,11.95 78,11.95
STATUS_LED
  Top 0.254: IC3.58 54.72,22.2 58.67,18.25 STATUS.A
SW
  pour Top (no thermals): 77.9,9.05 81.9,9.05 81.9,10.05 82.9,10.05 82.9,7.05 81.9,6.05 81.9,4.05 76.9,4.05 76.9,8.05
TX_D0
  Top 0.254: JP2.P$2 31.35,32.34 31.35,31.15 32.8,29.7 IC3.3
TXD1  (via drill 0.38)
  Top 0.254: IC3.46 46.8,15.65 46.95,15.5 61.5,15.5 64.9,18.9 v64.9,21.05
  Bottom 0.254: v64.9,21.05 64.9,29.05 64.38,29.57 CAM.4
TXD2
  Top 0.203: 34.94,24.72 IC3.13
  Top 0.254: IC3.13 30.25,24.7 26.9,28.05 26.9,33.05 25.9,34.05 15.9,34.05 13.9,36.05 13.9,37.64 U2.42
TXD3  (via drill 0.38)
  Top 0.254: IC3.64 51.8,25.2 52.35,25.75 54.6,25.75 55.9,27.05 v55.9,29.05
  Bottom 0.254: v55.9,29.05 57.9,29.05 60.9,32.05 63.9,32.05 64.9,31.05 72.52,31.05 AUX.4
V_BATT_DIV  (via drill 0.38)
  Top 0.254: IC3.87 43.3,30.45 v42.9,30.05 | R5.1 R100.2 34.9,7.95 v34.9,8.05
  Bottom 0.254: v42.9,30.05 42.9,27.05 46.9,23.05 46.9,20.05 49.9,17.05 49.9,12.05 44.9,7.05 35.9,7.05 v34.9,8.05
VBAT  (via drill 0.38)
  Top 0.152: 20.32,48.18 20.2,48.3 19.9,48.3 19.7,48.5 19.7,48.8 19.3,49.2
  Top 0.254: U2.18 10.61,48.16 11.07,48.62 16.72,48.62 17.54,49.44 R6.2 19.04,49.2 19.3,49.2 | 20.31,48.19 C10.1 | C10.1 20.32,48.18 | C10.1 22.03,48.18 v22.9,49.05
  Bottom 0.254: v22.9,49.05 22.9,47.5 C30.VCC
VCC_EN  (via drill 0.38)
  Top 0.254: v46.9,8.05 46.9,5.05 42.55,0.7 35,0.7 34.9,0.8 34.9,3.05 34.4,3.55 R24.1 | v47.9,29.05 48.8,29.95 IC3.76
  Bottom 0.254: v46.9,8.05 50.9,12.05 50.9,17.05 47.9,20.05 v47.9,29.05
VFB
  Top 0.406: U$5.P$7 82.24,15.09
  Top 0.61: 82.24,15.09 R33.1
VINR  (via drill 0.38, 0.4)
  Top 0.406: U$5.P$2 87.26,10.91 v87.4,10.75 | v87.95,15.35 88.55,14.75 R29.1 R30.2
  Bottom 0.406: v87.4,10.75 88.9,12.05 88.9,14.55 88.75,14.55 v87.95,15.35
WINCH_EN  (via drill 0.38)
  Top 0.254: IC3.73 53.55,29.7 58.9,35.05 v58.9,37.05 | v58.9,45.05 59.12,45.25 R9.1
  Bottom 0.254: v58.9,37.05 v58.9,45.05
WIND_EN  (via drill 0.38)
  Top 0.254: v36.9,39.05 37.9,38.05 38.9,38.05 v40.9,36.05 | v45.9,29.05 v48.9,26.05 | v48.9,22.05 49.25,21.7 IC3.57 | R10.2 37.1,42.85 v36.9,43.05
  Bottom 0.254: v40.9,36.05 40.9,34.05 v45.9,29.05 | v48.9,26.05 v48.9,22.05 | v36.9,39.05 v36.9,43.05
WN_V  (via drill 0.38)
  Top 0.254: IC3.24 36.05,19.2 37.9,21.05 v37.9,22.05 | v35.9,37.05 v35.9,40.05
  Bottom 0.254: v37.9,22.05 37.9,35.05 v35.9,37.05 | v35.9,40.05 35.9,46.05 40.9,51.05 48.34,51.05 S_WINCH.3
WS_1
  Top 0.254: WIND.4 42.3,36.14 IC3.89
WS_2
  Top 0.254: WIND.3 42.8,38.18 IC3.88
XTAL1
  Top 0.254: IC3.34 40.8,15.7 41.8,14.7 41.94,14.7 R12.1 42.6,14.24 Y1.3
XTAL2
  Top 0.254: Y1.1 40.26,12.74 R12.2 40.3,14.84 IC3.33

### Text on the board
Bottom: ARDUSAILOR V6
tPlace: Y | Z | X
tNames: GND | GND | VCC | GND | WS1 | WS2 | GND | GND | GND | SOLAR | GND | GND | BATTERY